# Altium schematic sheet GPRS-ADM2483-V1.0_______中科院TF卡.SchDoc
size A0
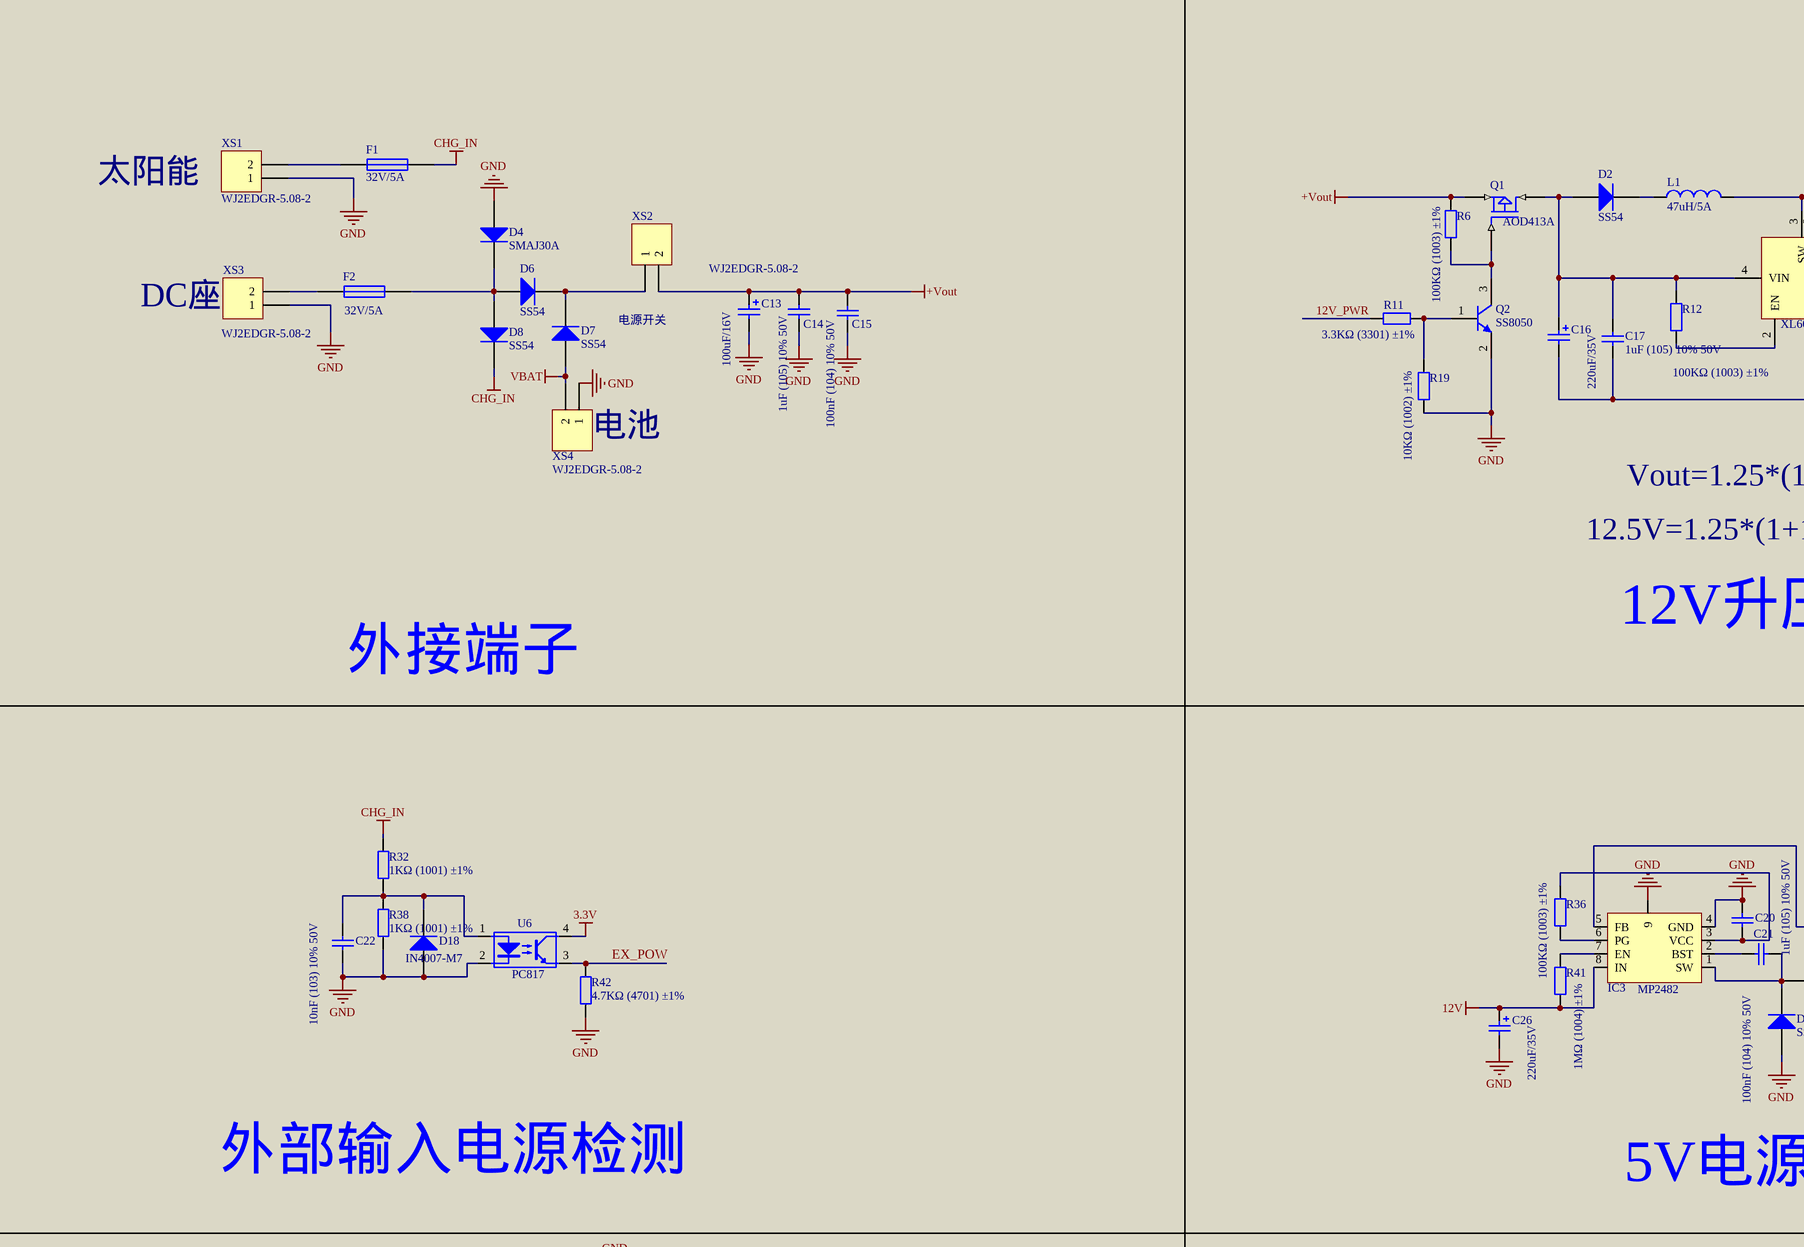
[diagram p0: GPRS-ADM2483-V1.0_______中科院TF卡.SchDoc, top left]
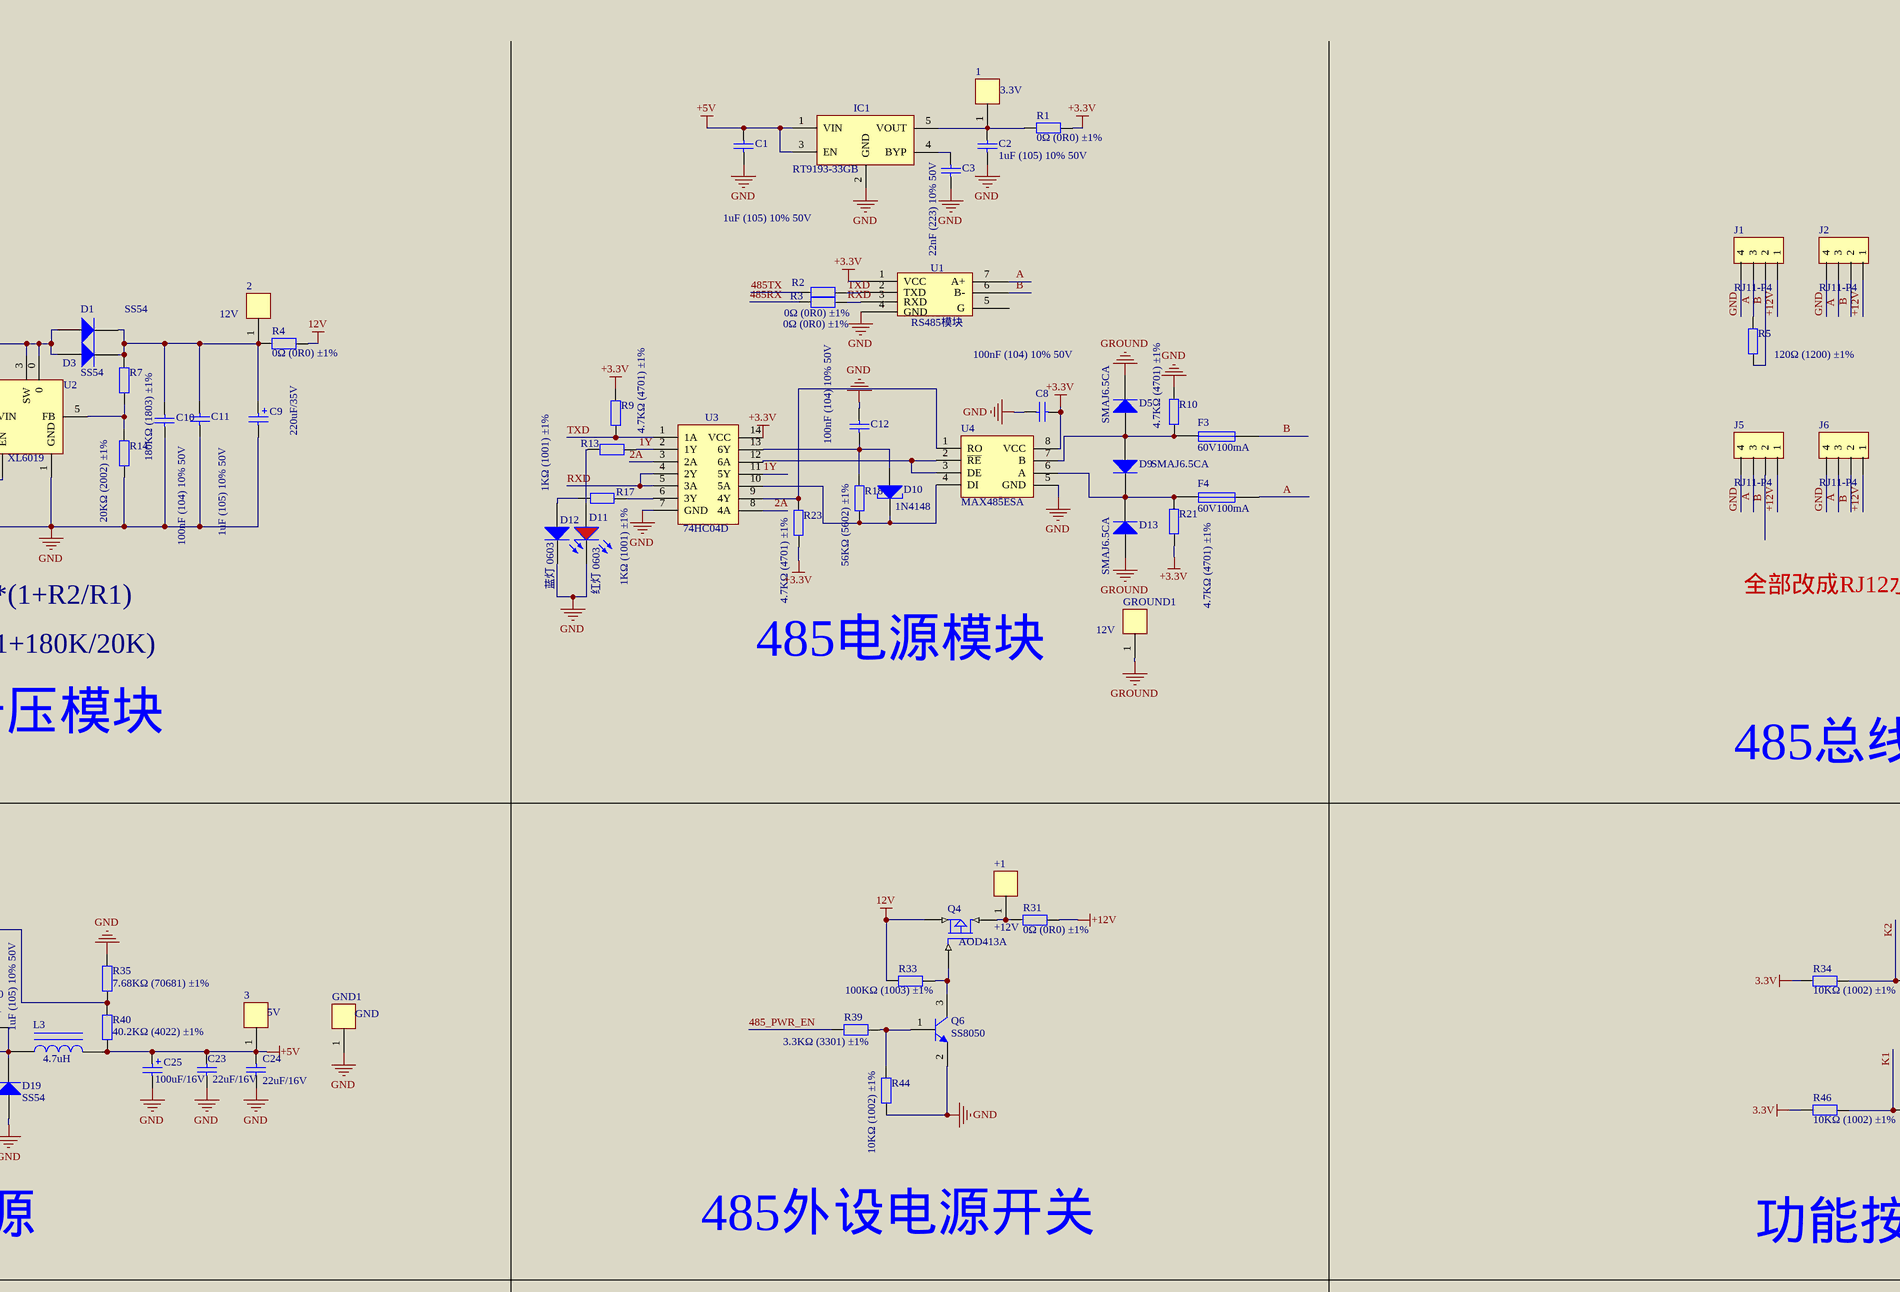
[diagram p1: GPRS-ADM2483-V1.0_______中科院TF卡.SchDoc, top middle]
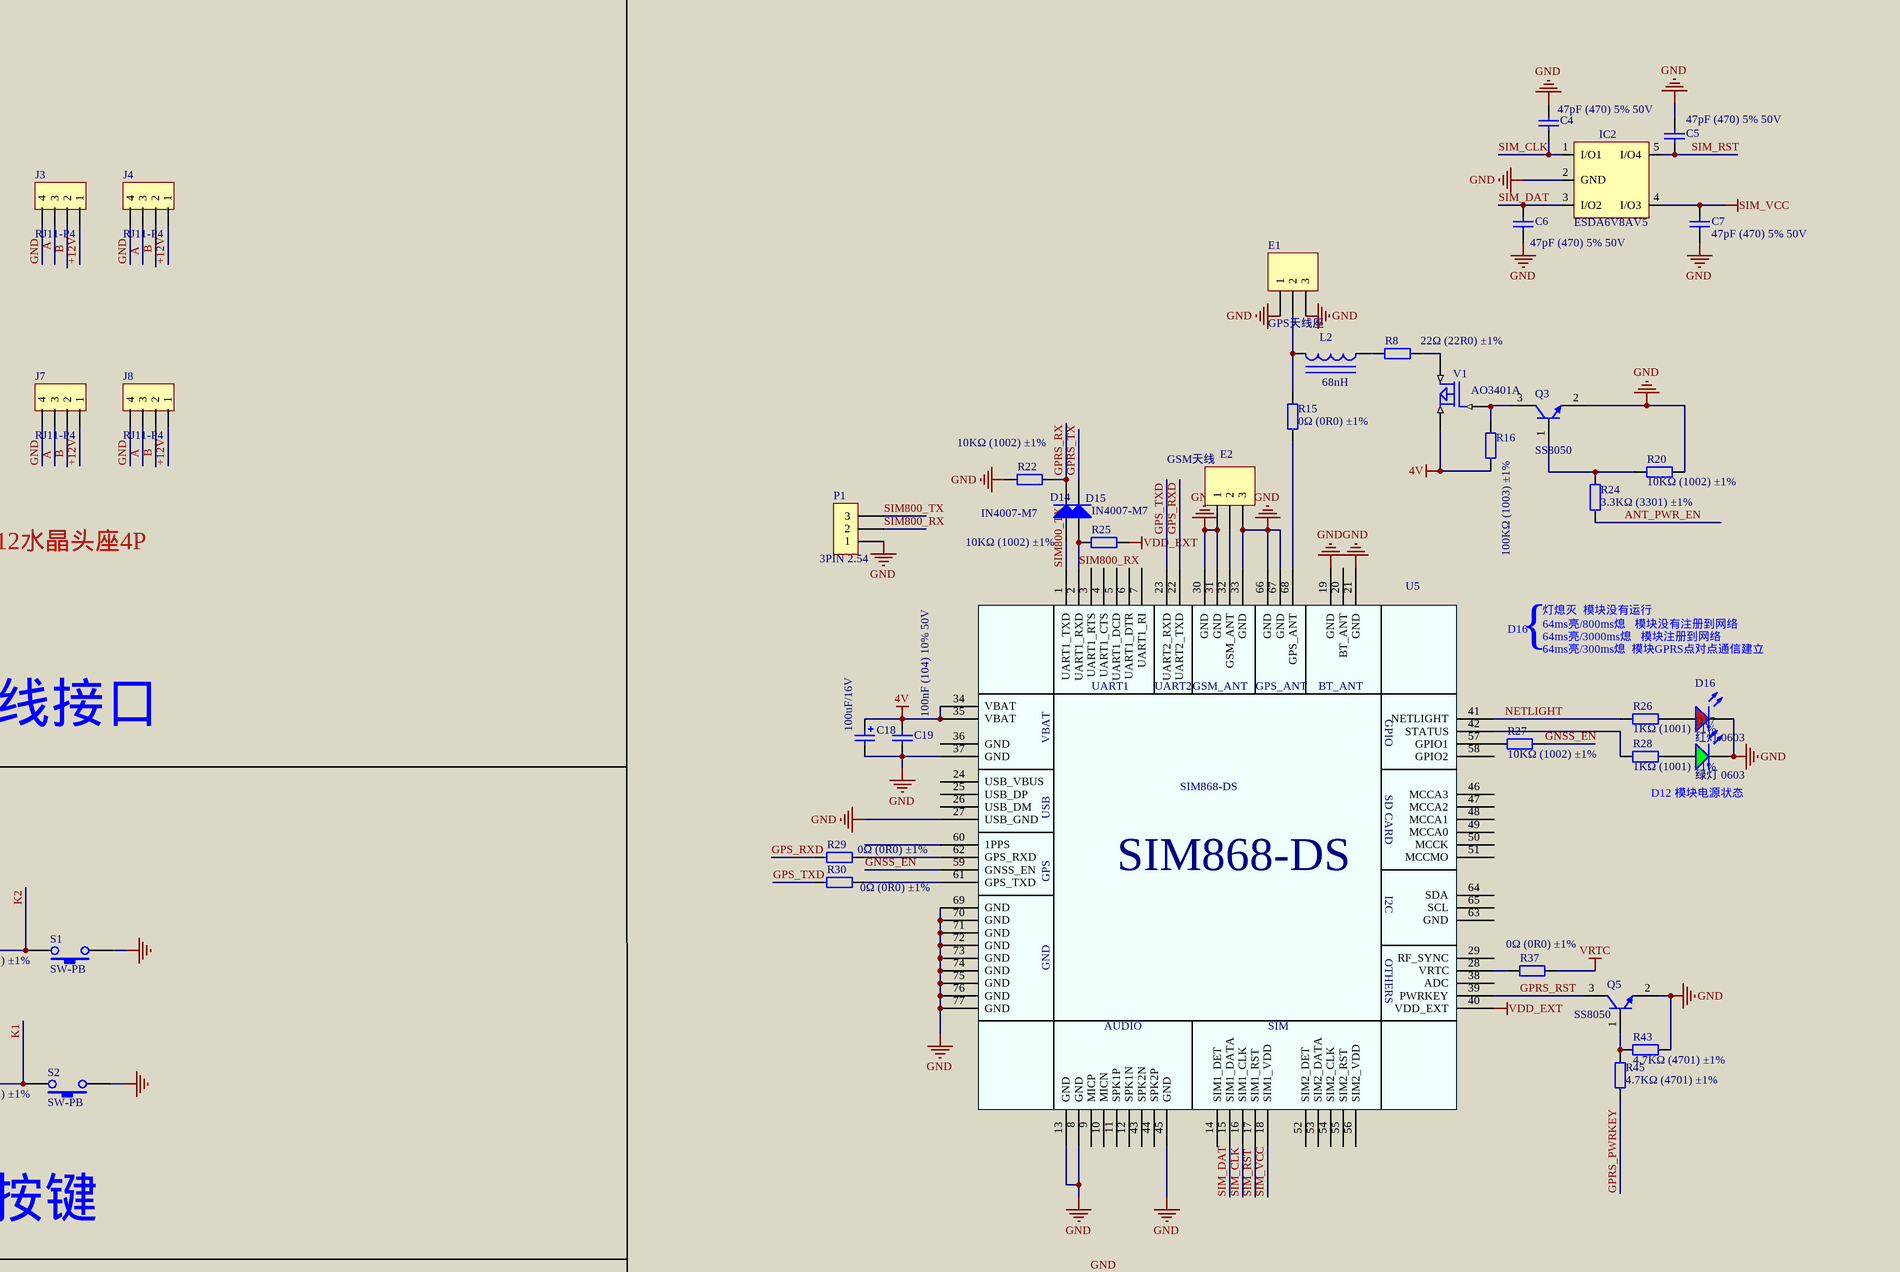
[diagram p2: GPRS-ADM2483-V1.0_______中科院TF卡.SchDoc, top right]
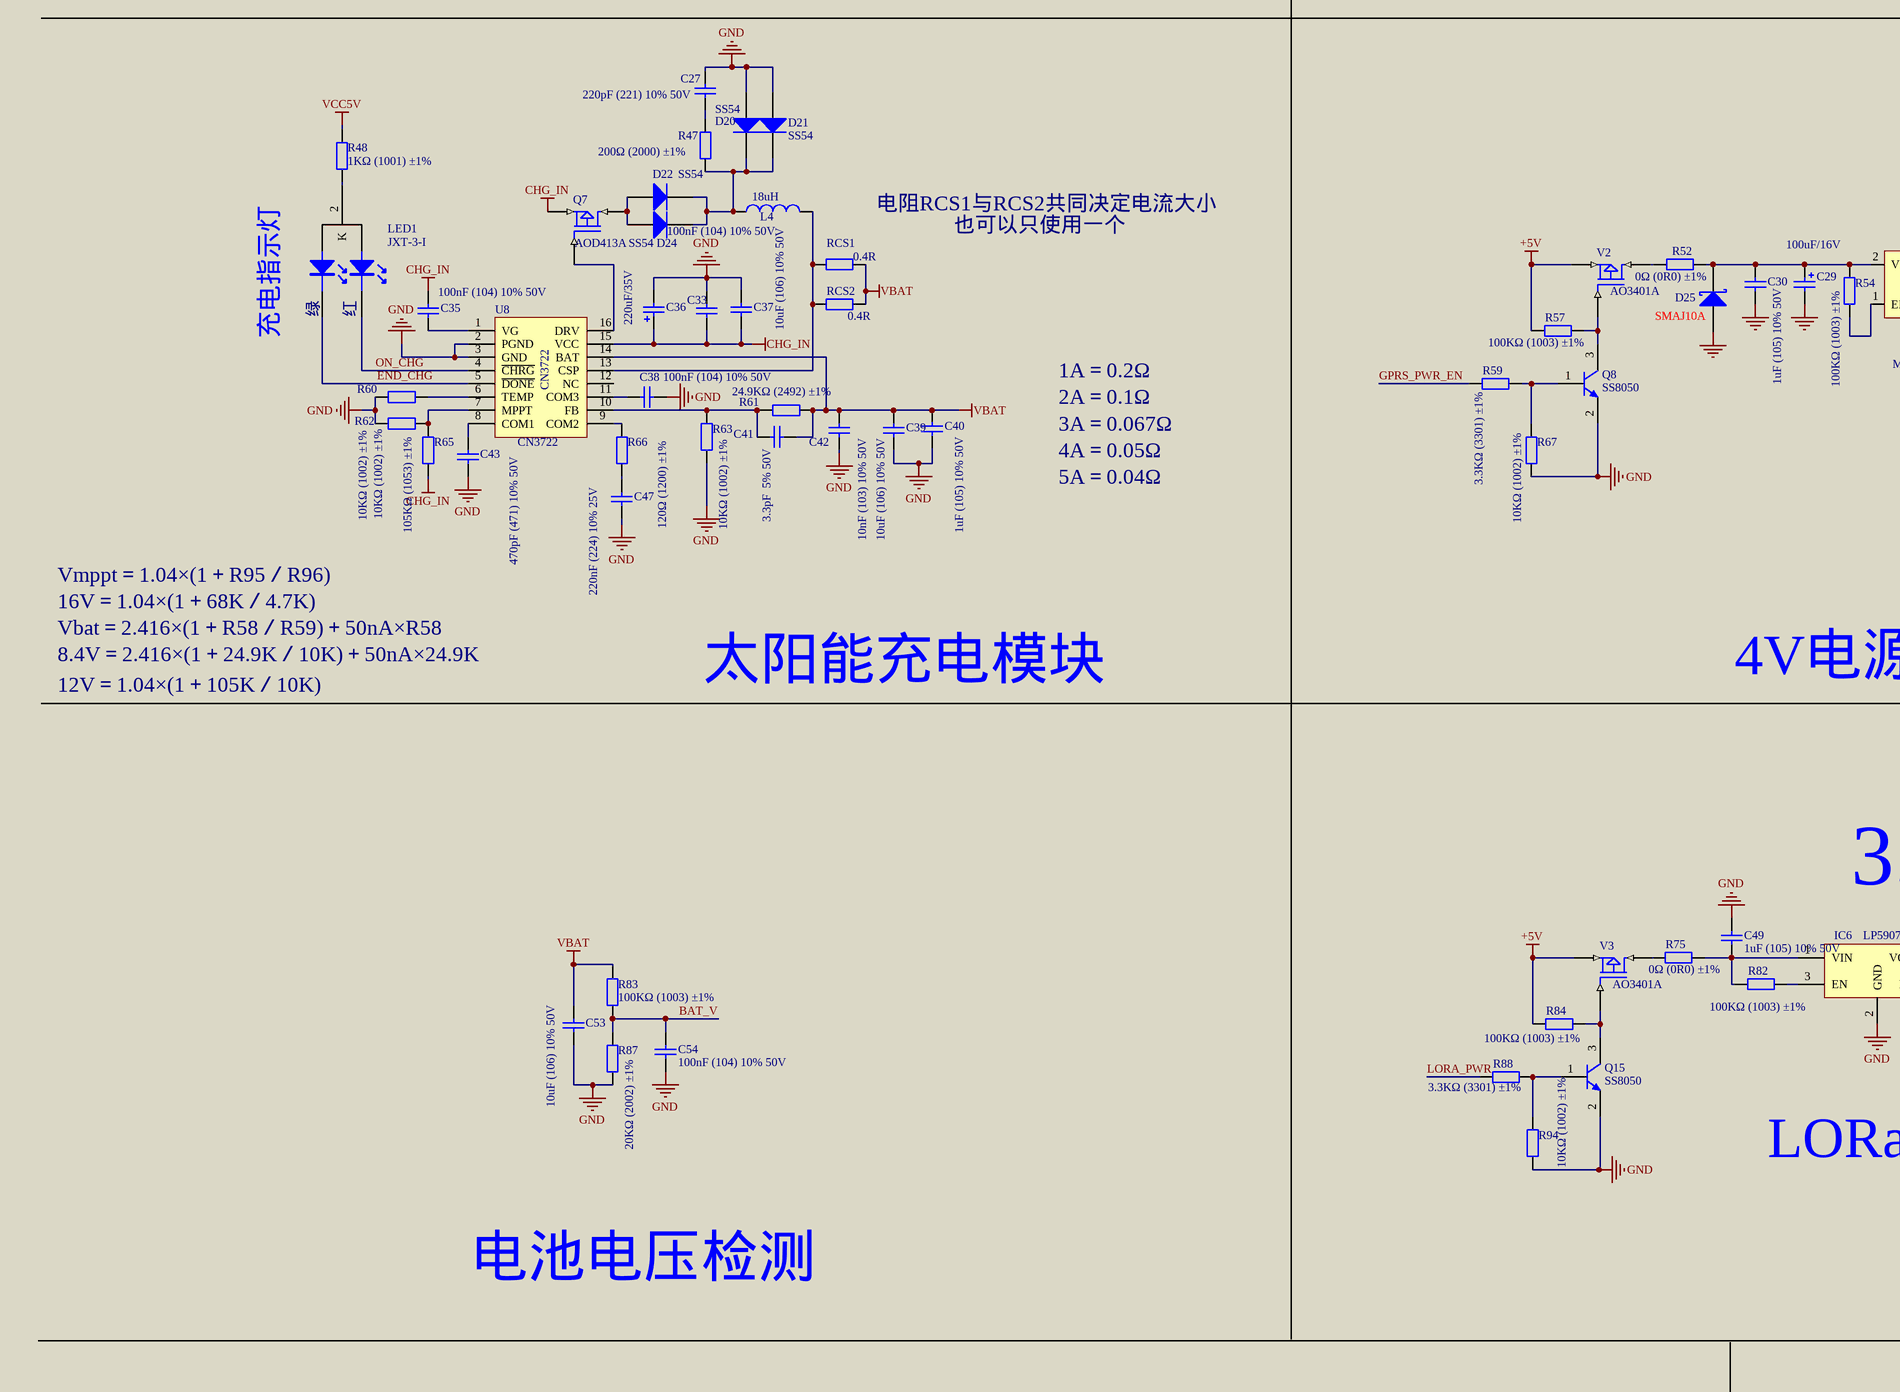
[diagram p3: GPRS-ADM2483-V1.0_______中科院TF卡.SchDoc, centre left]
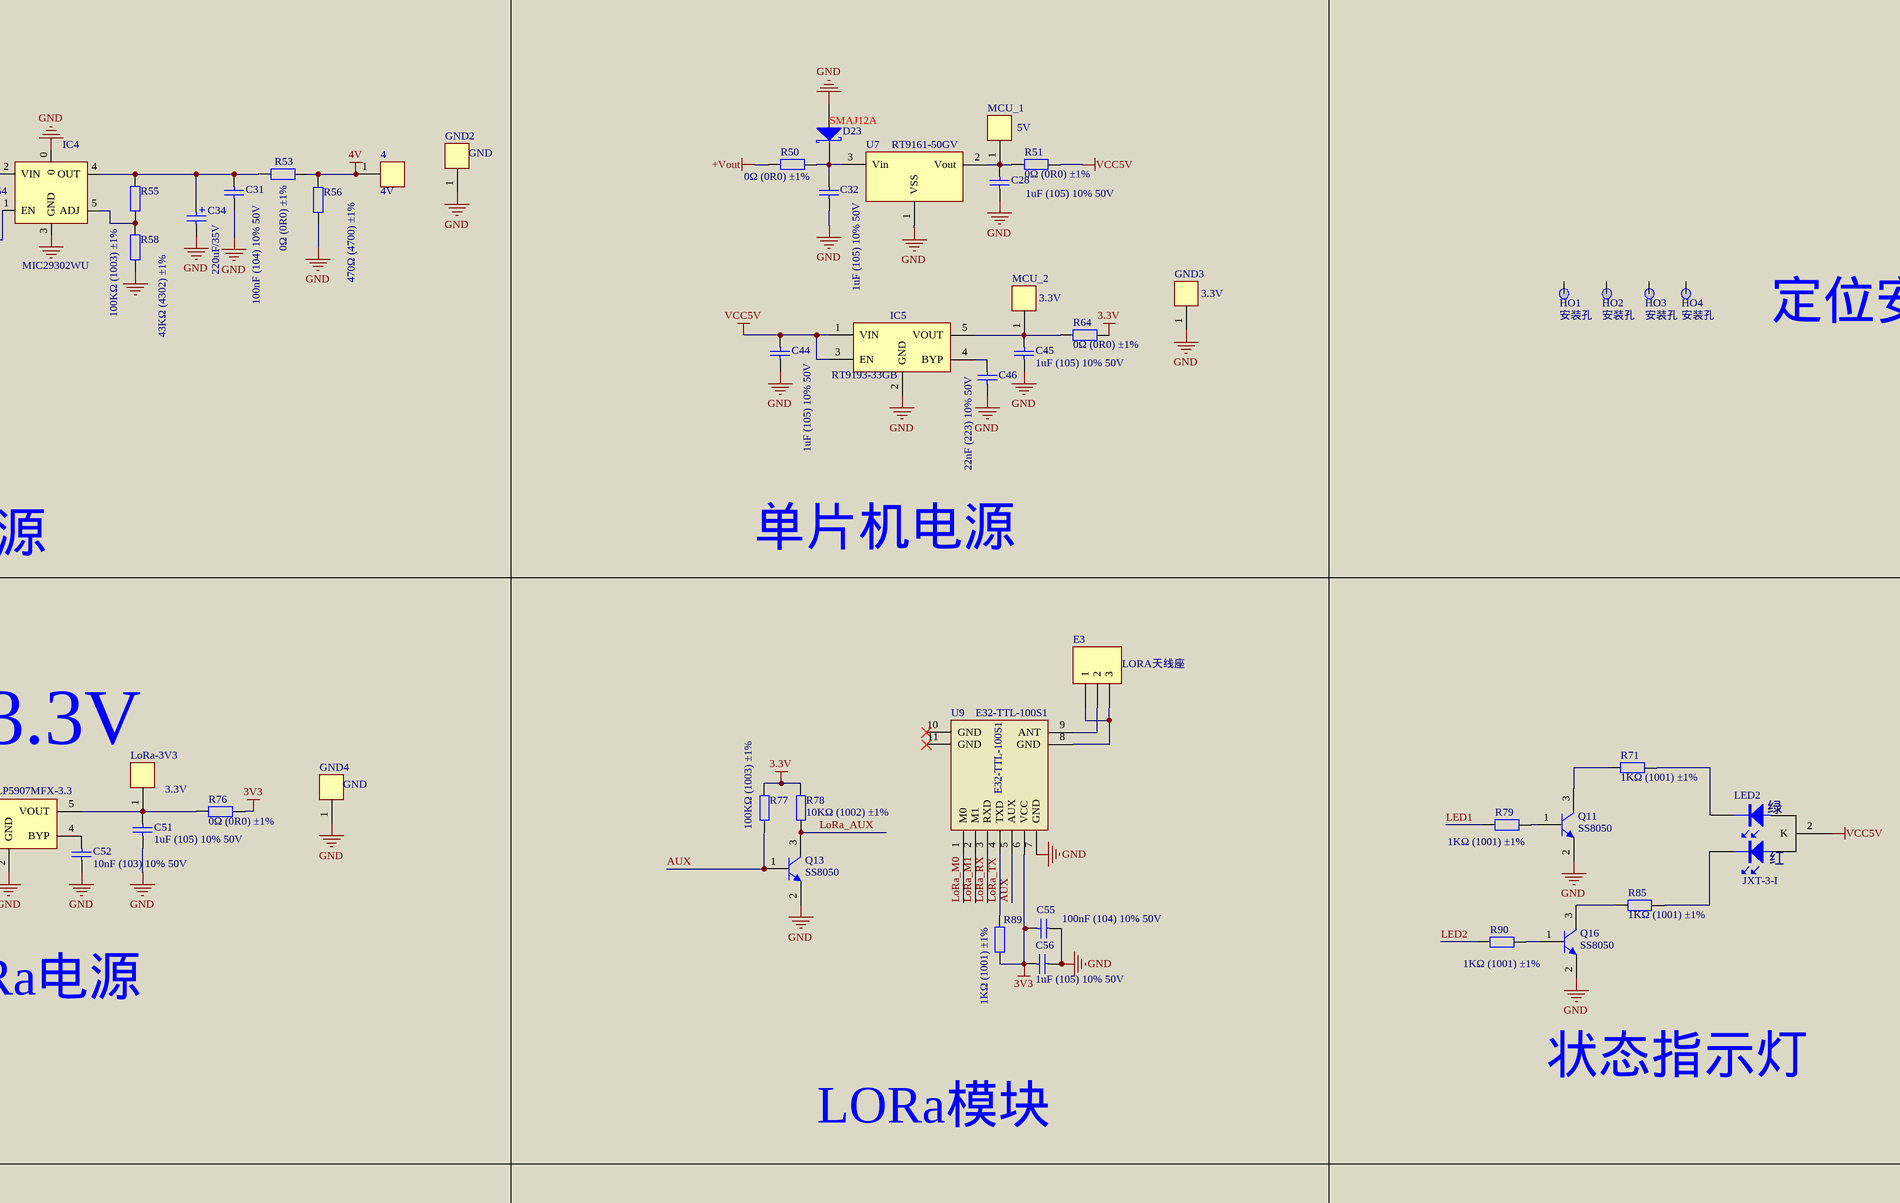
[diagram p4: GPRS-ADM2483-V1.0_______中科院TF卡.SchDoc, centre middle]
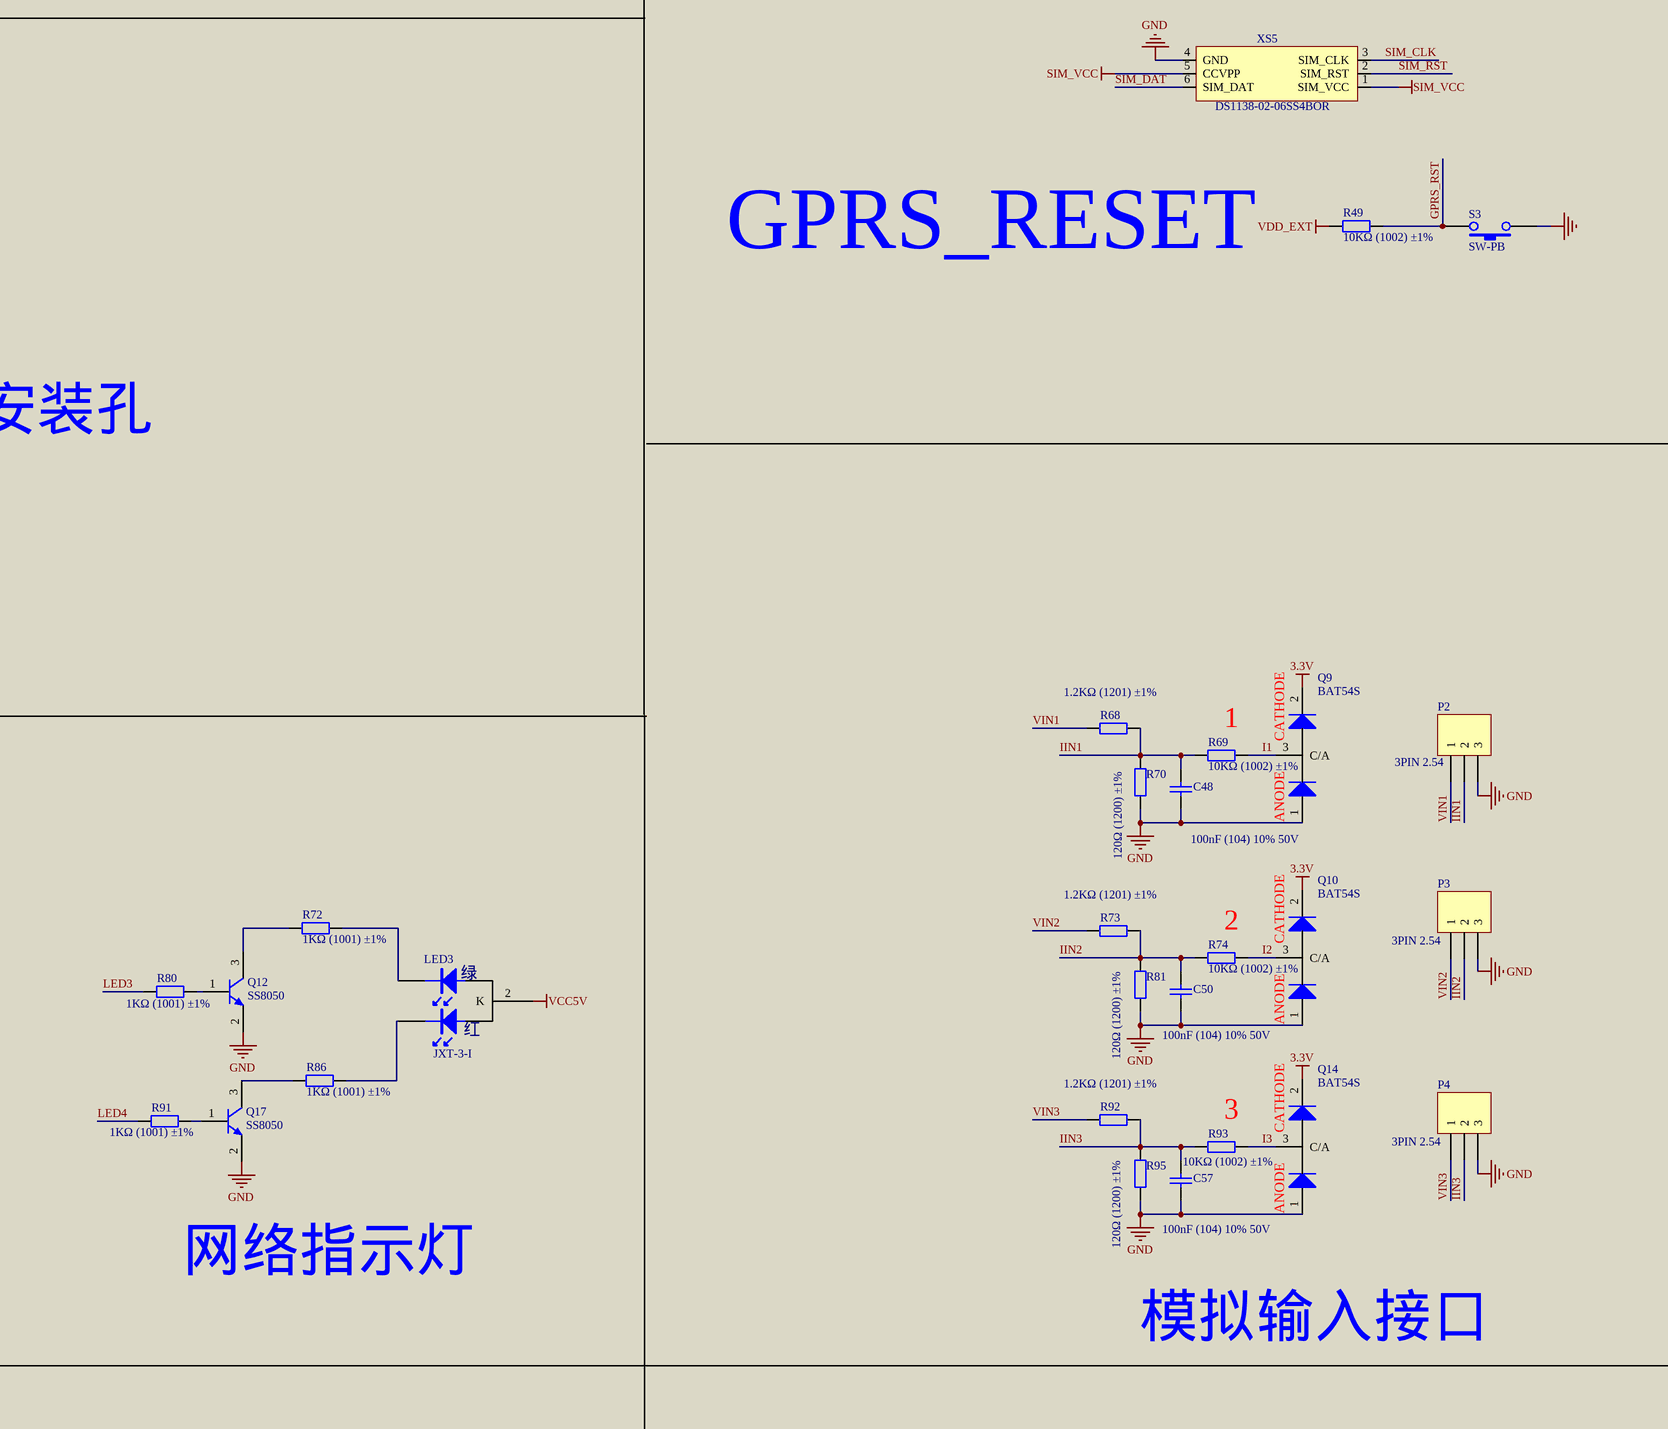
[diagram p5: GPRS-ADM2483-V1.0_______中科院TF卡.SchDoc, centre right]
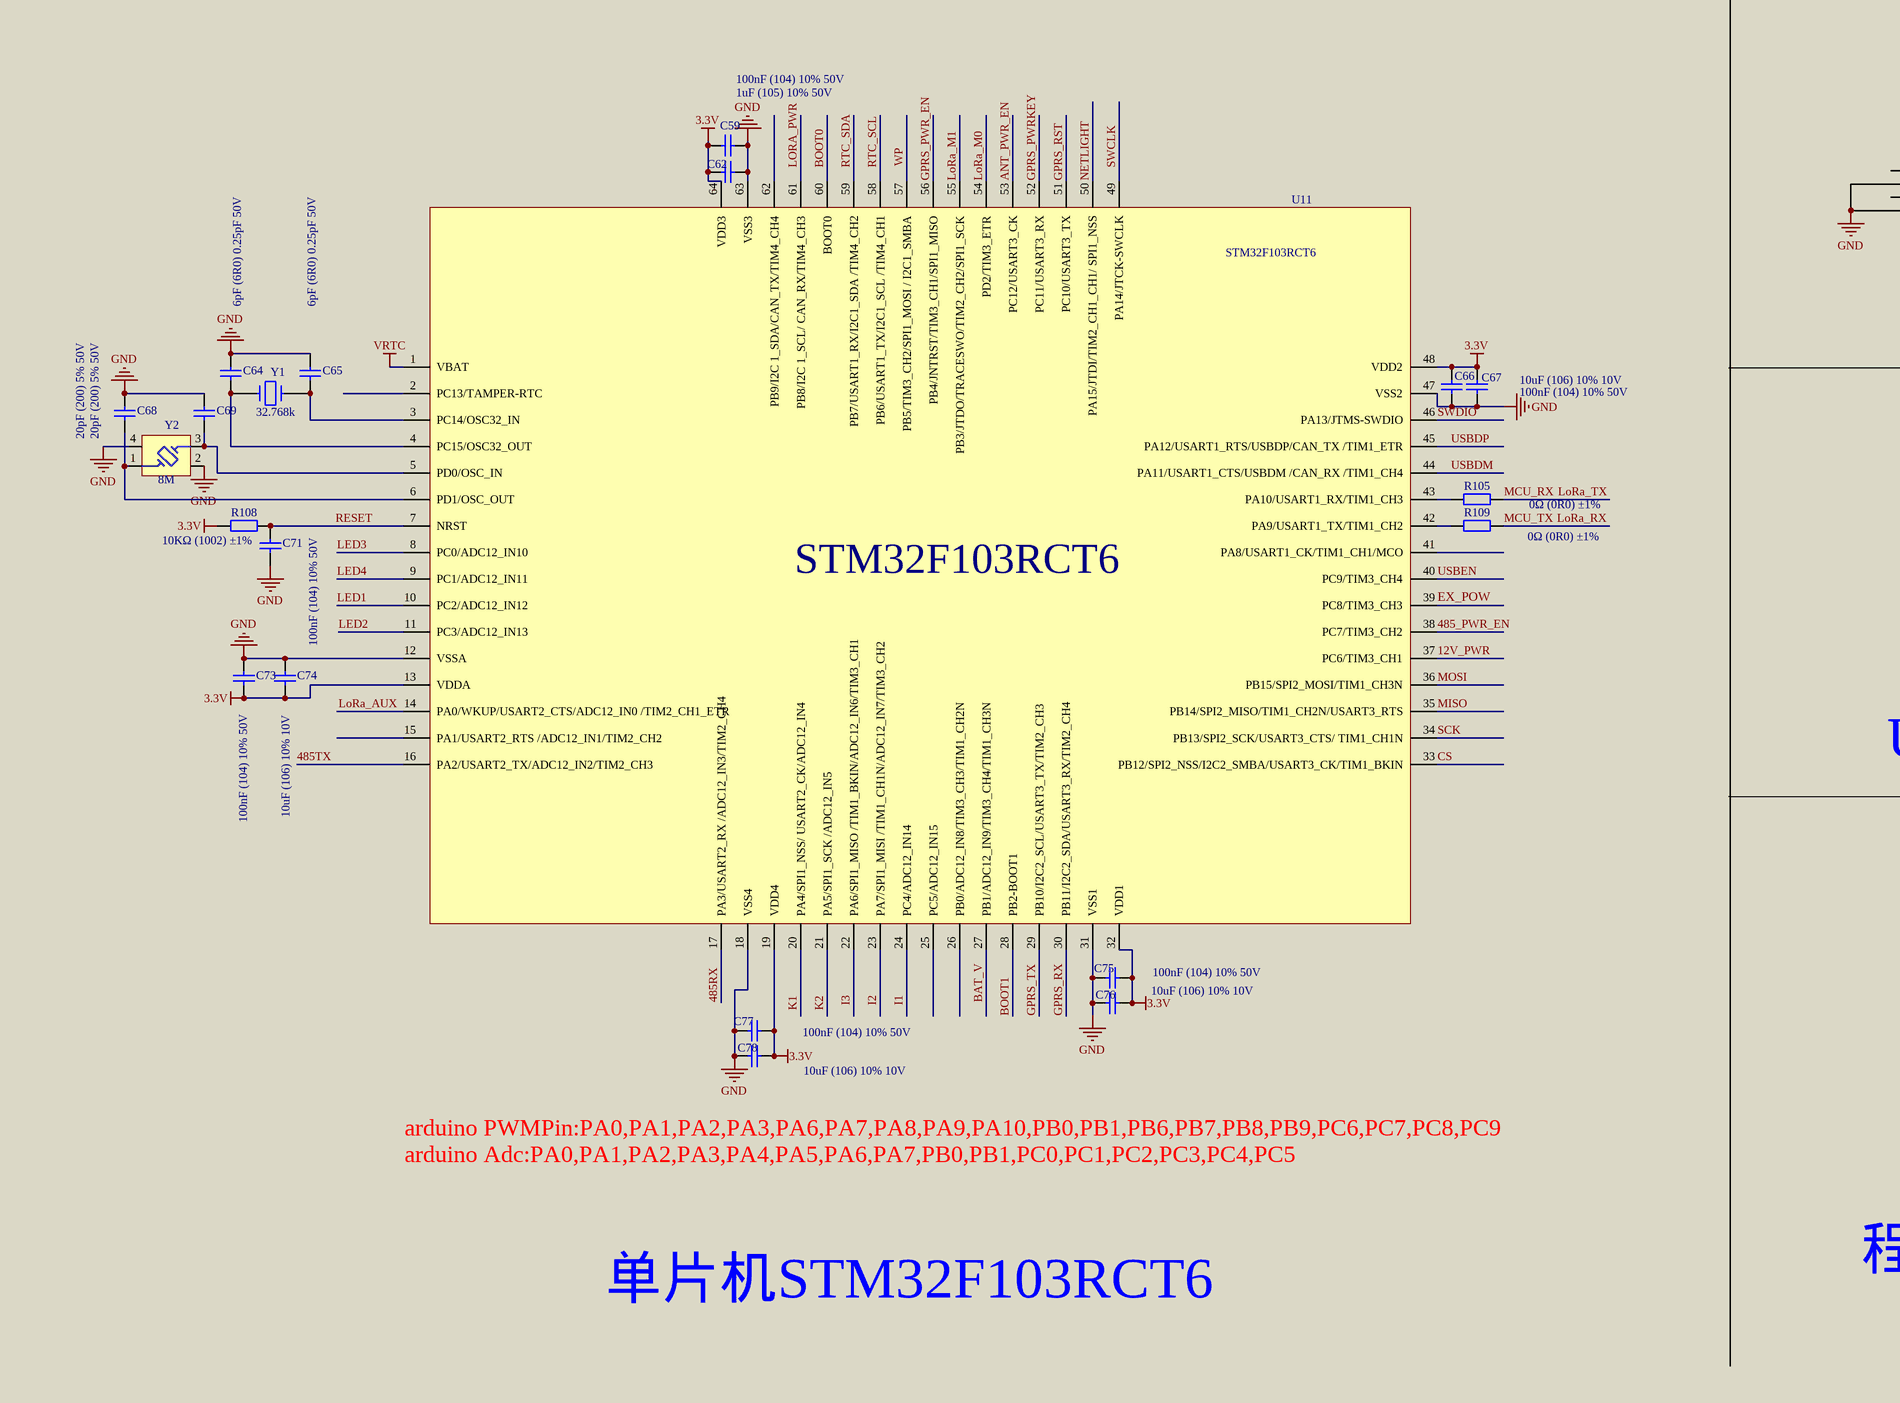
[diagram p6: GPRS-ADM2483-V1.0_______中科院TF卡.SchDoc, bottom left]
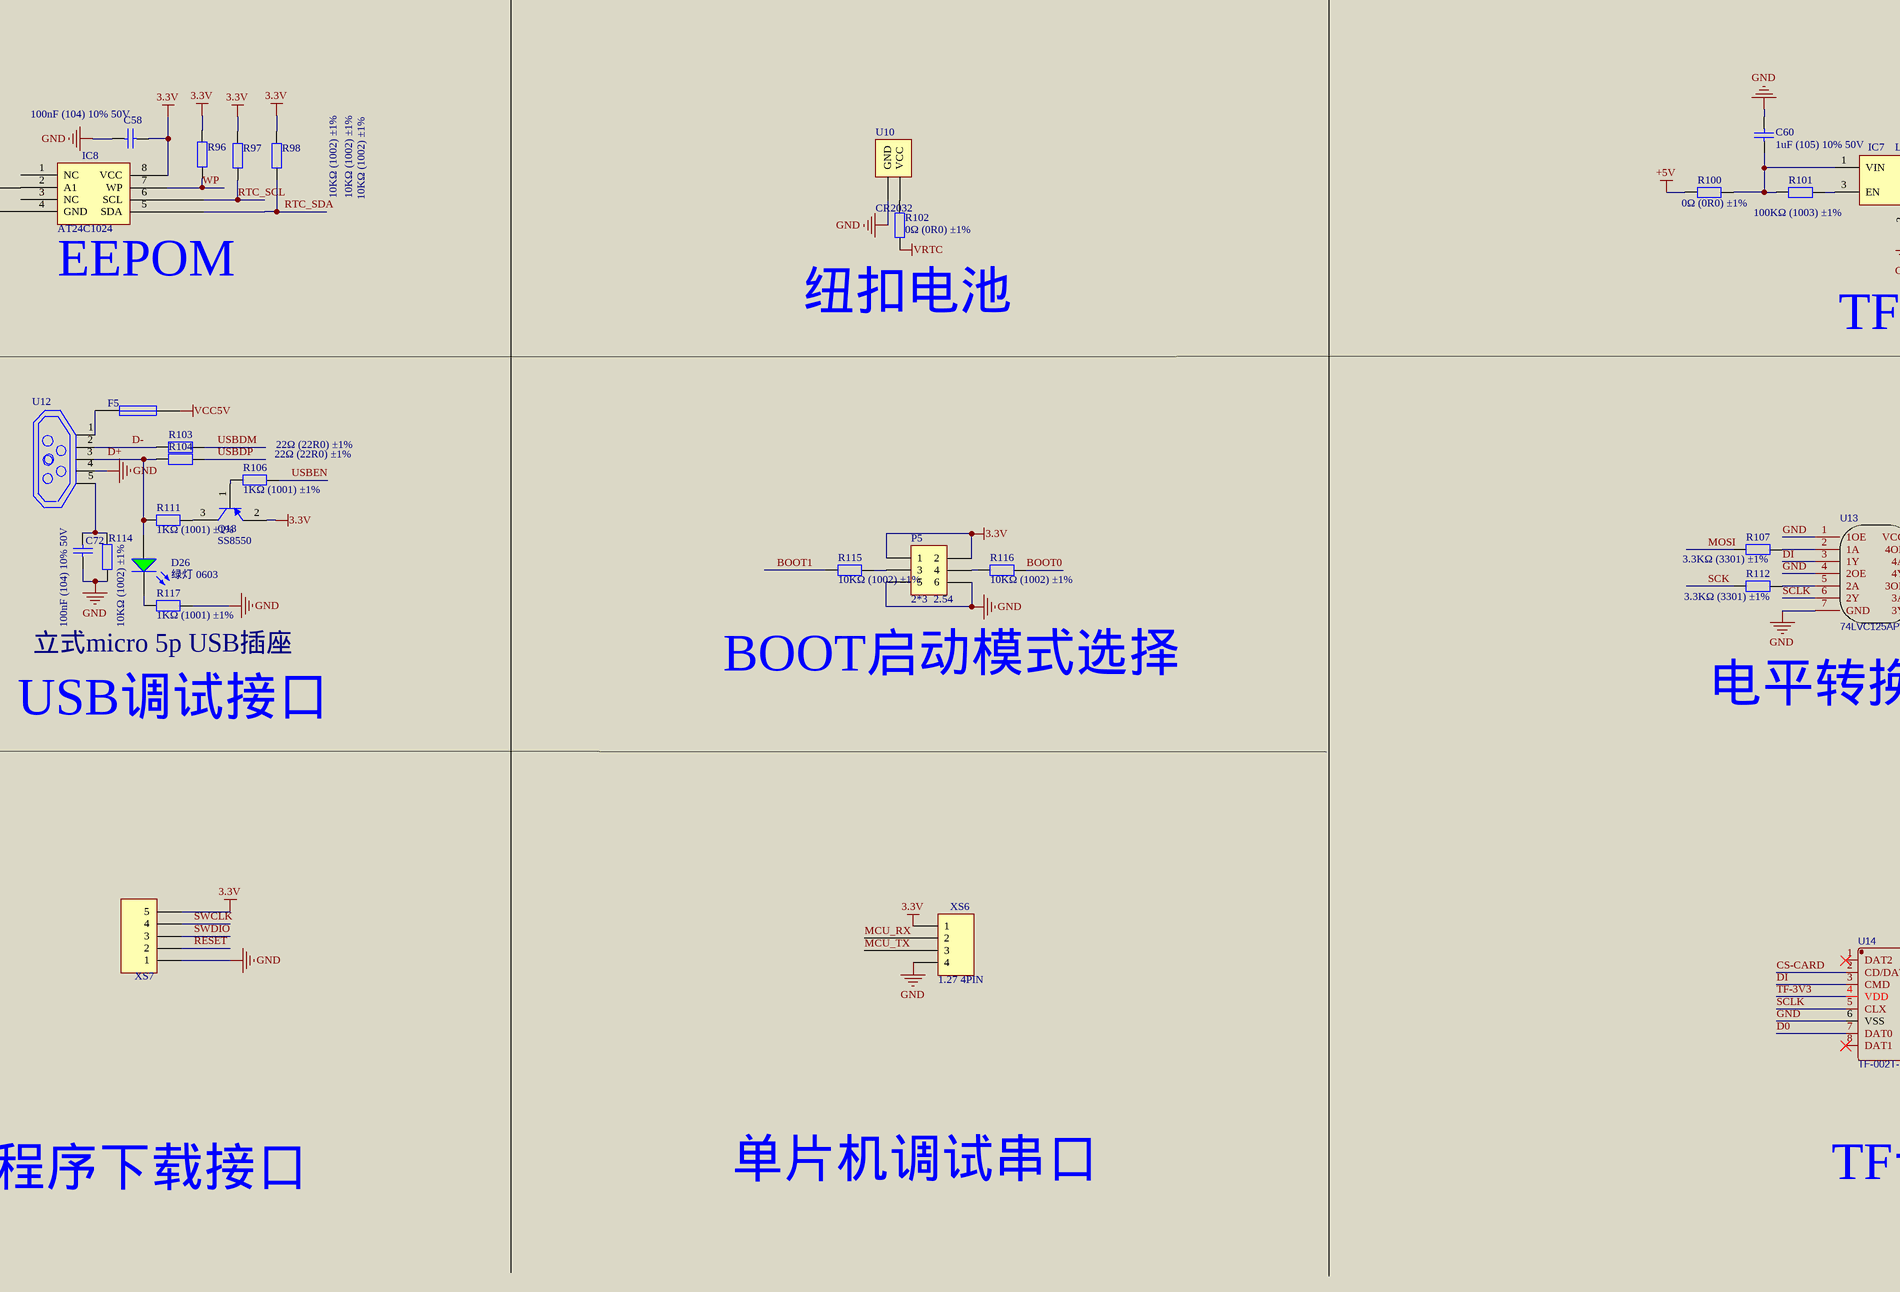
[diagram p7: GPRS-ADM2483-V1.0_______中科院TF卡.SchDoc, bottom middle]
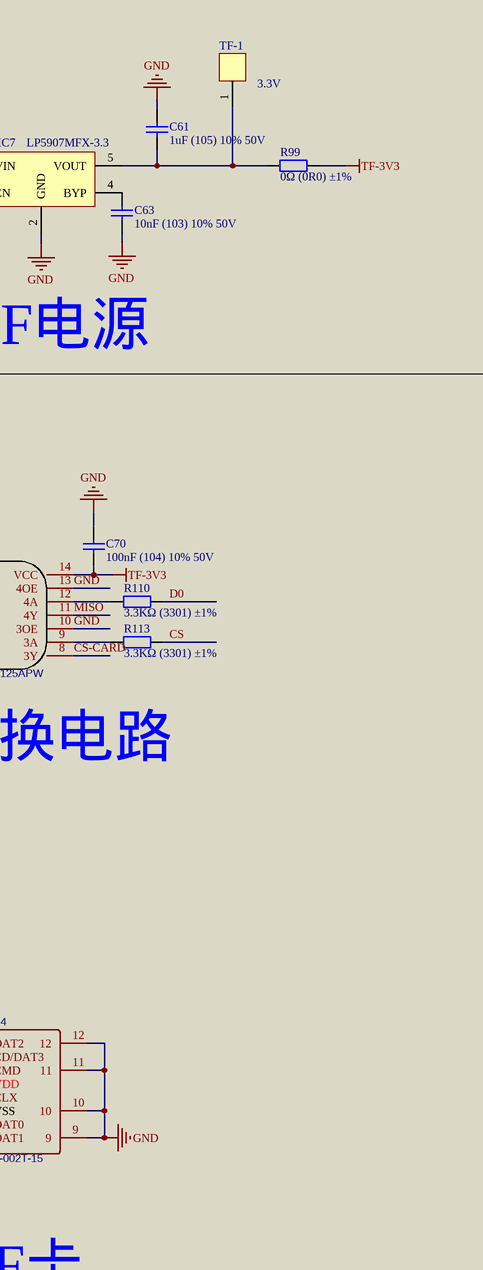
[diagram p8: GPRS-ADM2483-V1.0_______中科院TF卡.SchDoc, bottom right]

## Parts
1  3.3V  [TEST_POINT]
2  12V  [TEST_POINT]
3  5V  [TEST_POINT]
4  4V  [TEST_POINT]
+1  +12V  [TEST_POINT]
C1  1uF (105) 10% 50V  [LC-0603_C]
C2  1uF (105) 10% 50V  [LC-0603_C]
C3  22nF (223) 10% 50V  [LC-0603_C]
C4  47pF (470) 5% 50V  [LC-0603_C]
C5  47pF (470) 5% 50V  [LC-0603_C]
C6  47pF (470) 5% 50V  [LC-0603_C]
C7  47pF (470) 5% 50V  [LC-0603_C]
C8  100nF (104) 10% 50V  [LC-0603_C]
C9  220uF/35V  [CAPAE8*10.5]
C10  100nF (104) 10% 50V  [LC-0603_C]
C11  1uF (105) 10% 50V  [LC-0603_C]
C12  100nF (104) 10% 50V  [LC-0603_C]
C13  100uF/16V  [CAPAE6.3*7.7]
C14  1uF (105) 10% 50V  [LC-0603_C]
C15  100nF (104) 10% 50V  [LC-0603_C]
C16  220uF/35V  [CAPAE8*10.5]
C17  1uF (105) 10% 50V  [LC-0603_C]
C18  100uF/16V  [CAPAE6.3*7.7]
C19  100nF (104) 10% 50V  [LC-0603_C]
C20  1uF (105) 10% 50V  [LC-0603_C]
C21  100nF (104) 10% 50V  [LC-0603_C]
C22  10nF (103) 10% 50V  [LC-0603_C]
C23  22uF/16V  [C-1206]
C24  22uF/16V  [C-1206]
C25  100uF/16V  [CAPAE6.3*7.7]
C26  220uF/35V  [CAPAE8*10.5]
C27  220pF (221) 10% 50V  [LC-0603_C]
C28  1uF (105) 10% 50V  [LC-0603_C]
C29  100uF/16V  [CAPAE6.3*7.7]
C30  1uF (105) 10% 50V  [LC-0603_C]
C31  100nF (104) 10% 50V  [LC-0603_C]
C32  1uF (105) 10% 50V  [LC-0603_C]
C33  100nF (104) 10% 50V  [LC-0603_C]
C34  220uF/35V  [CAPAE8*10.5]
C35  100nF (104) 10% 50V  [LC-0603_C]
C36  220uF/35V  [CAPAE8*10.5]
C37  10uF (106) 10% 50V  [LC-1206_C]
C38  100nF (104) 10% 50V  [LC-0603_C]
C39  10uF (106) 10% 50V  [LC-1206_C]
C40  1uF (105) 10% 50V  [LC-0603_C]
C41  3.3pF  5% 50V  [LC-0603_C]
C42  10nF (103) 10% 50V  [LC-0603_C]
C43  470pF (471) 10% 50V  [LC-0603_C]
C44  1uF (105) 10% 50V  [LC-0603_C]
C45  1uF (105) 10% 50V  [LC-0603_C]
C46  22nF (223) 10% 50V  [LC-0603_C]
C47  220nF (224) 10% 25V  [LC-0603_C]
C48  100nF (104) 10% 50V  [LC-0603_C]
C49  1uF (105) 10% 50V  [LC-0603_C]
C50  100nF (104) 10% 50V  [LC-0603_C]
C51  1uF (105) 10% 50V  [LC-0603_C]
C52  10nF (103) 10% 50V  [LC-0603_C]
C53  10uF (106) 10% 50V  [LC-1206_C]
C54  100nF (104) 10% 50V  [LC-0603_C]
C55  100nF (104) 10% 50V  [LC-0603_C]
C56  1uF (105) 10% 50V  [LC-0603_C]
C57  100nF (104) 10% 50V  [LC-0603_C]
C58  100nF (104) 10% 50V  [LC-0603_C]
C59  1uF (105) 10% 50V  [LC-0603_C]
C60  1uF (105) 10% 50V  [LC-0603_C]
C61  1uF (105) 10% 50V  [LC-0603_C]
C62  100nF (104) 10% 50V  [LC-0603_C]
C63  10nF (103) 10% 50V  [LC-0603_C]
C64  6pF (6R0) 0.25pF 50V  [LC-0603_C]
C65  6pF (6R0) 0.25pF 50V  [LC-0603_C]
C66  10uF (106) 10% 10V  [LC-0603_C]
C67  100nF (104) 10% 50V  [LC-0603_C]
C68  20pF (200) 5% 50V  [LC-0603_C]
C69  20pF (200) 5% 50V  [LC-0603_C]
C70  100nF (104) 10% 50V  [LC-0603_C]
C71  100nF (104) 10% 50V  [LC-0603_C]
C72  100nF (104) 10% 50V  [LC-0603_C]
C73  100nF (104) 10% 50V  [LC-0603_C]
C74  10uF (106) 10% 10V  [LC-0603_C]
C75  100nF (104) 10% 50V  [LC-0603_C]
C76  10uF (106) 10% 10V  [LC-0603_C]
C77  100nF (104) 10% 50V  [LC-0603_C]
C78  10uF (106) 10% 10V  [LC-0603_C]
D1  SS54  [LC-SMA(DO-214AC)_S1]
D2  SS54  [LC-SMA(DO-214AC)_S1]
D3  SS54  [LC-SMA(DO-214AC)_S1]
D4  SMAJ30A  [LC-SMA(DO-214AC)_S5]
D5  SMAJ6.5CA  [DO-214AC]
D6  SS54  [LC-SMA(DO-214AC)_S1]
D7  SS54  [LC-SMA(DO-214AC)_S1]
D8  SS54  [LC-SMA(DO-214AC)_S1]
D9  SMAJ6.5CA  [DO-214AC]
D10  1N4148  [LL-34]
D11  红灯 0603  [LC-0603_LED_S1]
D12  蓝灯 0603  [LC-0603_LED_S1]
D13  SMAJ6.5CA  [DO-214AC]
D14  IN4007-M7  [SMA(DO-214AC)]
D15  IN4007-M7  [SMA(DO-214AC)]
D16  红灯 0603  [LC-0603_LED_S1]
D17  绿灯 0603  [LC-0603_LED_S1]
D18  IN4007-M7  [SMA(DO-214AC)]
D19  SS54  [LC-SMA(DO-214AC)_S1]
D20  SS54  [LC-SMA(DO-214AC)_S1]
D21  SS54  [LC-SMA(DO-214AC)_S1]
D22  SS54  [LC-SMA(DO-214AC)_S1]
D23  SMAJ12A  [SMA(DO-214AC)]
D24  SS54  [LC-SMA(DO-214AC)_S1]
D25  SMAJ10A  [SMA(DO-214AC)]
D26  绿灯 0603  [LC-0603_LED_S1]
E1  GPS天线座  [IPEX1]
E2  GSM天线  [IPEX1]
E3  LORA天线座  [IPEX1]
F1  32V/5A  [Fuse-1206]
F2  32V/5A  [Fuse-1206]
F3  60V100mA  [Fuse-1812]
F4  60V100mA  [Fuse-1812]
F5  32V/5A  [FUSE-1206]  (value not drawn)
GND1  GND  [TEST_POINT]
GND2  GND  [TEST_POINT]
GND3  3.3V  [TEST_POINT]
GND4  GND  [TEST_POINT]
GROUND1  12V  [TEST_POINT]
HO1  安装孔  [安装孔]
HO2  安装孔  [安装孔]
HO3  安装孔  [安装孔]
HO4  安装孔  [安装孔]
IC1  RT9193-33GB  [SOT23-5]
IC2  ESDA6V8AV5  [SOT-553]
IC3  MP2482  [SO8 -TP]
IC4  MIC29302WU  [MIC29302WU]
IC5  RT9193-33GB  [SOT23-5]
IC6  LP5907MFX-3.3  [SOT23-5]
IC7  LP5907MFX-3.3  [SOT23-5]
IC8  AT24C1024  [SO8]
J1  RJ11-P4  [RJ11_P4]
J2  RJ11-P4  [RJ11_P4]
J3  RJ11-P4  [RJ11_P4]
J4  RJ11-P4  [RJ11_P4]
J5  RJ11-P4  [RJ11_P4]
J6  RJ11-P4  [RJ11_P4]
J7  RJ11-P4  [RJ11_P4]
J8  RJ11-P4  [RJ11_P4]
L1  47uH/5A  [Inductot(47uH)]
L2  68nH  [L-0805]
L3  4.7uH  [GDCD8040]
L4  18uH  [GDCD8040]
LED1  JXT-3-I  [JXT-3-l]
LED2  JXT-3-I  [JXT-3-l]
LED3  JXT-3-I  [JXT-3-l]
LoRa-3V3  3.3V  [TEST_POINT]
MCU_1  5V  [TEST_POINT]
MCU_2  3.3V  [TEST_POINT]
P1  3PIN 2.54  [HDR1X3]
P2  3PIN 2.54  [WJ2EDGR-5.08-3]
P3  3PIN 2.54  [WJ2EDGR-5.08-3]
P4  3PIN 2.54  [WJ2EDGR-5.08-3]
P5  2*3  2.54  [201S2X3]
Q1  AOD413A  [TO-252-2]
Q2  SS8050  [SOT-23]
Q3  SS8050  [SOT-23]
Q4  AOD413A  [TO-252-2]
Q5  SS8050  [SOT-23]
Q6  SS8050  [SOT-23]
Q7  AOD413A  [TO-252-2]
Q8  SS8050  [SOT-23]
Q9  BAT54S  [SOT-23-3]
Q10  BAT54S  [SOT-23-3]
Q11  SS8050  [SOT-23]
Q12  SS8050  [SOT-23]
Q13  SS8050  [SOT-23]
Q14  BAT54S  [SOT-23-3]
Q15  SS8050  [SOT-23]
Q16  SS8050  [SOT-23]
Q17  SS8050  [SOT-23]
Q18  SS8550  [SOT-23]
R1  0Ω (0R0) ±1%  [LC-0603_R]
R2  0Ω (0R0) ±1%  [LC-0603_R]
R3  0Ω (0R0) ±1%  [LC-0603_R]
R4  0Ω (0R0) ±1%  [LC-0603_R]
R5  120Ω (1200) ±1%  [LC-0603_R]
R6  100KΩ (1003) ±1%  [LC-0603_R]
R7  180KΩ (1803) ±1%  [LC-0603_R]
R8  22Ω (22R0) ±1%  [LC-0603_R]
R9  4.7KΩ (4701) ±1%  [LC-0603_R]
R10  4.7KΩ (4701) ±1%  [LC-0603_R]
R11  3.3KΩ (3301) ±1%  [LC-0603_R]
R12  100KΩ (1003) ±1%  [LC-0603_R]
R13  1KΩ (1001) ±1%  [LC-0603_R]
R14  20KΩ (2002) ±1%  [LC-0603_R]
R15  0Ω (0R0) ±1%  [LC-0603_R]
R16  100KΩ (1003) ±1%  [LC-0603_R]
R17  1KΩ (1001) ±1%  [LC-0603_R]
R18  56KΩ (5602) ±1%  [LC-0603_R]
R19  10KΩ (1002) ±1%  [LC-0603_R]
R20  10KΩ (1002) ±1%  [LC-0603_R]
R21  4.7KΩ (4701) ±1%  [LC-0603_R]
R22  10KΩ (1002) ±1%  [LC-0603_R]
R23  4.7KΩ (4701) ±1%  [LC-0603_R]
R24  3.3KΩ (3301) ±1%  [LC-0603_R]
R25  10KΩ (1002) ±1%  [LC-0603_R]
R26  1KΩ (1001) ±1%  [LC-0603_R]
R27  10KΩ (1002) ±1%  [LC-0603_R]
R28  1KΩ (1001) ±1%  [LC-0603_R]
R29  0Ω (0R0) ±1%  [LC-0603_R]
R30  0Ω (0R0) ±1%  [LC-0603_R]
R31  0Ω (0R0) ±1%  [LC-0603_R]
R32  1KΩ (1001) ±1%  [LC-0603_R]
R33  100KΩ (1003) ±1%  [LC-0603_R]
R34  10KΩ (1002) ±1%  [LC-0603_R]
R35  7.68KΩ (70681) ±1%  [LC-0603_R]
R36  100KΩ (1003) ±1%  [LC-0603_R]
R37  0Ω (0R0) ±1%  [LC-0603_R]
R38  1KΩ (1001) ±1%  [LC-0603_R]
R39  3.3KΩ (3301) ±1%  [LC-0603_R]
R40  40.2KΩ (4022) ±1%  [LC-0603_R]
R41  1MΩ (1004) ±1%  [LC-0603_R]
R42  4.7KΩ (4701) ±1%  [LC-0603_R]
R43  4.7KΩ (4701) ±1%  [LC-0603_R]
R44  10KΩ (1002) ±1%  [LC-0603_R]
R45  4.7KΩ (4701) ±1%  [LC-0603_R]
R46  10KΩ (1002) ±1%  [LC-0603_R]
R47  200Ω (2000) ±1%  [LC-0603_R]
R48  1KΩ (1001) ±1%  [LC-0603_R]
R49  10KΩ (1002) ±1%  [LC-0603_R]
R50  0Ω (0R0) ±1%  [LC-0603_R]
R51  0Ω (0R0) ±1%  [LC-0603_R]
R52  0Ω (0R0) ±1%  [LC-0603_R]
R53  0Ω (0R0) ±1%  [LC-0603_R]
R54  100KΩ (1003) ±1%  [LC-0603_R]
R55  100KΩ (1003) ±1%  [LC-0603_R]
R56  470Ω (4700) ±1%  [LC-0603_R]
R57  100KΩ (1003) ±1%  [LC-0603_R]
R58  43KΩ (4302) ±1%  [LC-0603_R]
R59  3.3KΩ (3301) ±1%  [LC-0603_R]
R60  10KΩ (1002) ±1%  [LC-0603_R]
R61  24.9KΩ (2492) ±1%  [LC-0603_R]
R62  10KΩ (1002) ±1%  [LC-0603_R]
R63  10KΩ (1002) ±1%  [LC-0603_R]
R64  0Ω (0R0) ±1%  [LC-0603_R]
R65  105KΩ (1053) ±1%  [LC-0603_R]
R66  120Ω (1200) ±1%  [LC-0603_R]
R67  10KΩ (1002) ±1%  [LC-0603_R]
R68  1.2KΩ (1201) ±1%  [LC-0603_R]
R69  10KΩ (1002) ±1%  [LC-0603_R]
R70  120Ω (1200) ±1%  [LC-0603_R]
R71  1KΩ (1001) ±1%  [LC-0603_R]
R72  1KΩ (1001) ±1%  [LC-0603_R]
R73  1.2KΩ (1201) ±1%  [LC-0603_R]
R74  10KΩ (1002) ±1%  [LC-0603_R]
R75  0Ω (0R0) ±1%  [LC-0603_R]
R76  0Ω (0R0) ±1%  [LC-0603_R]
R77  100KΩ (1003) ±1%  [LC-0603_R]
R78  10KΩ (1002) ±1%  [LC-0603_R]
R79  1KΩ (1001) ±1%  [LC-0603_R]
R80  1KΩ (1001) ±1%  [LC-0603_R]
R81  120Ω (1200) ±1%  [LC-0603_R]
R82  100KΩ (1003) ±1%  [LC-0603_R]
R83  100KΩ (1003) ±1%  [LC-0603_R]
R84  100KΩ (1003) ±1%  [LC-0603_R]
R85  1KΩ (1001) ±1%  [LC-0603_R]
R86  1KΩ (1001) ±1%  [LC-0603_R]
R87  20KΩ (2002) ±1%  [LC-0603_R]
R88  3.3KΩ (3301) ±1%  [LC-0603_R]
R89  1KΩ (1001) ±1%  [LC-0603_R]
R90  1KΩ (1001) ±1%  [LC-0603_R]
R91  1KΩ (1001) ±1%  [LC-0603_R]
R92  1.2KΩ (1201) ±1%  [LC-0603_R]
R93  10KΩ (1002) ±1%  [LC-0603_R]
R94  10KΩ (1002) ±1%  [LC-0603_R]
R95  120Ω (1200) ±1%  [LC-0603_R]
R96  10KΩ (1002) ±1%  [LC-0603_R]
R97  10KΩ (1002) ±1%  [LC-0603_R]
R98  10KΩ (1002) ±1%  [LC-0603_R]
R99  0Ω (0R0) ±1%  [LC-0603_R]
R100  0Ω (0R0) ±1%  [LC-0603_R]
R101  100KΩ (1003) ±1%  [LC-0603_R]
R102  0Ω (0R0) ±1%  [LC-0603_R]
R103  22Ω (22R0) ±1%  [LC-0603_R]
R104  22Ω (22R0) ±1%  [LC-0603_R]
R105  0Ω (0R0) ±1%  [LC-0603_R]
R106  1KΩ (1001) ±1%  [LC-0603_R]
R107  3.3KΩ (3301) ±1%  [LC-0603_R]
R108  10KΩ (1002) ±1%  [LC-0603_R]
R109  0Ω (0R0) ±1%  [LC-0603_R]
R110  3.3KΩ (3301) ±1%  [LC-0603_R]
R111  1KΩ (1001) ±1%  [LC-0603_R]
R112  3.3KΩ (3301) ±1%  [LC-0603_R]
R113  3.3KΩ (3301) ±1%  [LC-0603_R]
R114  10KΩ (1002) ±1%  [LC-0603_R]
R115  10KΩ (1002) ±1%  [LC-0603_R]
R116  10KΩ (1002) ±1%  [LC-0603_R]
R117  1KΩ (1001) ±1%  [LC-0603_R]
RCS1  0.4R  [R-2512]
RCS2  0.4R  [R-2512]
S1  SW-PB  [JXT-2-l]
S2  SW-PB  [JXT-2-l]
S3  SW-PB  [轻触(3*6*4.3)]
TF-1  3.3V  [TEST_POINT]
U1  RS485模块  [RS485MOD]
U2  XL6019  [TO-263-5]
U3  74HC04D  [SOIC-14_150mil]
U4  MAX485ESA  [SOP-8_150mil]
U5  SIM868-DS  [SIM868]
U6  PC817  [PC817]
U7  RT9161-50GV  [SOT-23-3]
U8  CN3722  [TSSOP-16]
U9  E32-TTL-100S1  [E32-TTL-100S1]
U10  CR2032  [CR2032 - 1]
U11  STM32F103RCT6  [LQFP-64_10x10x05P]
U12  立式micro 5p USB插座  [USB插座 micro 5p]
U13  74LVC125APW  [TSSOP-14]
U14  TF-002T-15  [TF-002T-15]
V1  AO3401A  [SOT-23-3L]
V2  AO3401A  [SOT-23-3L]
V3  AO3401A  [SOT-23-3L]
XS1  WJ2EDGR-5.08-2  [WJ2EDGR-5.08-2]
XS2  WJ2EDGR-5.08-2  [WJ2EDGR-5.08-2]
XS3  WJ2EDGR-5.08-2  [WJ2EDGR-5.08-2]
XS4  WJ2EDGR-5.08-2  [WJ2EDGR-5.08-2]
XS5  DS1138-02-06SS4BOR  [SIM-1]
XS6  1.27 4PIN  [JXT-4]
XS7  1.25X4  [JXT-5]  (value not drawn)
Y1  32.768k  [3215_32.768K]
Y2  8M  [SMD-5032_4P]

## Nets
3.3V: C58.2 C59.1 C62.1 C66.2 C67.2 C73.2 C74.2 C75.1 C76.1 C77.1 C78.1 IC8.8(VCC) P5.1 P5.2 Q9.2(CATHODE) Q10.2(CATHODE) Q14.2(CATHODE) Q18.2(E) R34.1 R46.1 R64.2 R77.2 R78.2 R96.2 R97.2 R98.2 R108.1 U6.4(Collector) U11.13(VDDA) U11.19(VDD4) U11.32(VDD1) U11.48(VDD2) U11.64(VDD3) XS6.1 XS7.5
3V3: C55.1 C56.1 R76.2 R89.1 U9.6(VCC)
4V: 4.1 C18.1 C19.2 R16.1 R53.2 R56.2 U5.34(VBAT) U5.35(VBAT) V1.2(S)
12V: C26.1 IC3.8(IN) Q4.3(S) R4.2 R33.1 R41.1
+3.3V: C8.1 R1.2 R9.2 R21.1 R23.1 U1.1(VCC) U3.14(VCC) U4.8(VCC)
+5V: 3.1 C1.2 C23.2 C24.2 C25.1 IC1.1(VIN) IC1.3(EN) L3.2 R40.1 R57.1 R84.1 R100.1 V2.2(S) V3.2(S)
+12V: J1.1 J2.1 J3.1 J4.1 J5.1 J6.1 J7.1 J8.1 R31.2
+Vout: C13.1 C14.2 C15.2 Q1.3(S) R6.2 R50.1 XS2.2
CHG_IN: C33.1 C35.2 C36.1 C37.1 D8.2(K) F1.2 Q7.3(S) R32.2 R65.2 U8.15(VCC)
GND: C1.1 C2.1 C3.1 C4.2 C5.2 C6.1 C7.1 C8.2 C9.2 C10.1 C11.1 C12.2 C13.2 C14.1 C15.1 C16.2 C17.1 C18.2 C19.1 C20.2 C22.1 C23.1 C24.1 C25.2 C26.2 C27.2 C28.1 C29.2 C30.1 C31.1 C32.1 C33.2 C34.2 C36.2 C37.2 C38.2 C39.1 C40.1 C42.1 C43.1 C44.1 C45.1 C46.1 C47.1 C48.1 C49.2 C50.1 C51.1 C52.1 C53.1 C54.1 C55.2 C56.2 C57.1 C58.1 C59.2 C60.2 C61.1 C62.2 C63.1 C64.2 C65.2 C66.1 C67.1 C68.2 C69.2 C70.2 C71.2 C72.1 C73.1 C74.1 C75.2 C76.2 C77.2 C78.2 D4.1(A) D11.K D12.K D16.K D17.K D18.1(A) D19.1(A) D20.1(A) D21.1(A) D23.1(A) D25.1(A) E1.1 E1.3 E2.1 E2.3 GND1.1 GND2.1 GND3.1 GND4.1 IC1.2(GND) IC2.2(GND) IC3.4(GND) IC3.9 IC4.0 IC4.3(GND) IC5.2(GND) IC6.2(GND) IC7.2(GND) IC8.2(A1) IC8.4(GND) J1.4 J2.4 J3.4 J4.4 J5.4 J6.4 J7.4 J8.4 P1.1 P2.3 P3.3 P4.3 P5.5 P5.6 Q2.2(E) Q3.2(E) Q5.2(E) Q6.2(E) Q8.2(E) Q9.1(ANODE) Q10.1(ANODE) Q11.2(E) Q12.2(E) Q13.2(E) Q14.1(ANODE) Q15.2(E) Q16.2(E) Q17.2(E) R10.1 R14.1 R19.1 R20.2 R22.1 R35.2 R38.1 R42.1 R43.2 R44.1 R56.1 R58.1 R60.1 R62.1 R63.1 R67.1 R70.1 R81.1 R87.1 R94.1 R95.1 R114.1 R117.2 S1.1 S2.1 S3.1 U1.4(GND) U2.1(GND) U3.7(GND) U4.5(GND) U5.8(GND) U5.13(GND) U5.19(GND) U5.21(GND) U5.27(USB_GND) U5.30(GND) U5.31(GND) U5.33(GND) U5.37(GND) U5.45(GND) U5.66(GND) U5.67(GND) U5.69(GND) U5.70(GND) U5.71(GND) U5.72(GND) U5.73(GND) U5.74(GND) U5.75(GND) U5.76(GND) U5.77(GND) U6.2(LED_Cathode) U7.1(VSS) U8.2(PGND) U8.3(GND) U9.7(GND) U10.2(GND) U11.12(VSSA) U11.18(VSS4) U11.31(VSS1) U11.47(VSS2) U11.63(VSS3) U12.4 U13.1(1OE) U13.4(2OE) U13.7(GND) U13.10(3OE) U13.13(4OE) U14.6(VSS) U14.9 U14.10 U14.11 U14.12 XS1.1 XS3.1 XS4.1 XS5.4(GND) XS6.4 XS7.1 Y2.2 Y2.4
GROUND: D5.2(K) D13.1(A) GROUND1.1
SIM_VCC: C7.2 IC2.4(I/O3) U5.18(SIM1_VDD) XS5.1(SIM_VCC) XS5.5(CCVPP)
TF-3V3: C70.1 R99.2 U13.14(VCC) U14.4(VDD)
VBAT: C39.2 C40.2 C41.2 C42.2 C53.2 D7.1(A) R61.2 R83.2 RCS1.1 RCS2.1 U8.14(BAT) XS4.2
VCC5V: C44.2 F5.2 IC5.1(VIN) IC5.3(EN) LED2.2(K) LED3.2(K) R48.2 R51.2
VDD_EXT: R25.2 R49.1 U5.40(VDD_EXT)
VRTC: R37.2 R102.1 U11.1(VBAT)
1Y: R13.2 U3.2(1Y) U3.11(5Y)
2A: U3.3(2A) U3.8(4A)
12V_PWR: R11.1 U11.37(PC6/TIM3_CH1)
485_PWR_EN: R39.1 U11.38(PC7/TIM3_CH2)
485RX: R3.1 U11.17(PA3/USART2_RX_/ADC12_IN3/TIM2_CH4)
485TX: R2.1 U11.16(PA2/USART2_TX/ADC12_IN2/TIM2_CH3)
A: F4.2 J1.3 J2.3 J3.3 J4.3 J5.3 J6.3 J7.3 J8.3 R5.2 U1.7(A+)
ANT_PWR_EN: R24.1 U11.53(PC12/USART3_CK)
AUX: Q13.1(B) R77.1 U9.5(AUX)
B: F3.2 J1.2 J2.2 J3.2 J4.2 J5.2 J6.2 J7.2 J8.2 R5.1 U1.6(B-)
BAT_V: C54.2 R83.1 R87.2 U11.27(PB1/ADC12_IN9/TIM3_CH4/TIM1_CH3N)
BOOT0: R116.2 U11.60(BOOT0)
BOOT1: R115.1 U11.28(PB2-BOOT1)
CS: R113.2 U11.33(PB12/SPI2_NSS/I2C2_SMBA/USART3_CK/TIM1_BKIN)
CS-CARD: U13.8(3Y) U14.2(CD/DAT3)
D0: R110.2 U14.7(DAT0)
D+: D26.A R104.1 R111.1 U12.3
D-: R103.1 U12.2
DI: U13.3(1Y) U14.3(CMD)
END_CHG: LED1.1(A) U8.5(~{DONE})
EX_POW: R42.2 U6.3(Emitter) U11.39(PC8/TIM3_CH3)
GNSS_EN: R27.2 U5.59(GNSS_EN)
GPRS_PWR_EN: R59.1 U11.56(PB4/JNTRST/TIM3_CH1/SPI1_MISO)
GPRS_PWRKEY: R45.1 U11.52(PC11/USART3_RX)
GPRS_RST: Q5.3(C) R49.2 S3.2 U5.39(PWRKEY) U11.51(PC10/USART3_TX)
GPRS_RX: D14.2(K) R22.2 U11.30(PB11/I2C2_SDA/USART3_RX/TIM2_CH4)
GPRS_TX: D15.2(K) U11.29(PB10/I2C2_SCL/USART3_TX/TIM2_CH3)
GPS_RXD: R29.1 U5.22(UART2_TXD)
GPS_TXD: R30.1 U5.23(UART2_RXD)
I1: Q9.3(C/A) R69.2 U11.24(PC4/ADC12_IN14)
I2: Q10.3(C/A) R74.2 U11.23(PA7/SPI1_MISI_/TIM1_CH1N/ADC12_IN7/TIM3_CH2)
I3: Q14.3(C/A) R93.2 U11.22(PA6/SPI1_MISO_/TIM1_BKIN/ADC12_IN6/TIM3_CH1)
IIN1: C48.2 P2.2 R68.2 R69.1 R70.2
IIN2: C50.2 P3.2 R73.2 R74.1 R81.2
IIN3: C57.2 P4.2 R92.2 R93.1 R95.2
K1: R46.2 S2.2 U11.20(PA4/SPI1_NSS/_USART2_CK/ADC12_IN4)
K2: R34.2 S1.2 U11.21(PA5/SPI1_SCK_/ADC12_IN5)
LED1: R79.1 U11.10(PC2/ADC12_IN12)
LED2: R90.1 U11.11(PC3/ADC12_IN13)
LED3: R80.1 U11.8(PC0/ADC12_IN10)
LED4: R91.1 U11.9(PC1/ADC12_IN11)
LoRa_AUX: Q13.3(C) R78.1 U11.14(PA0/WKUP/USART2_CTS/ADC12_IN0_/TIM2_CH1_ETR)
LoRa_M0: U9.1(M0) U11.54(PD2/TIM3_ETR)
LoRa_M1: U9.2(M1) U11.55(PB3/JTDO/TRACESWO/TIM2_CH2/SPI1_SCK)
LORA_PWR: R88.1 U11.61(PB8/I2C_1_SCL/_CAN_RX/TIM4_CH3)
LoRa_RX: R109.2 U9.3(RXD) XS6.3  [also labelled MCU_TX]
LoRa_TX: R89.2 R105.2 U9.4(TXD) XS6.2  [also labelled MCU_RX]
MISO: U11.35(PB14/SPI2_MISO/TIM1_CH2N/USART3_RTS) U13.11(4Y)
MOSI: R107.1 U11.36(PB15/SPI2_MOSI/TIM1_CH3N)
NETLIGHT: R26.1 U5.41(NETLIGHT) U11.50(PA15/JTDI/TIM2_CH1_CH1/_SPI1_NSS)
ON_CHG: LED1.3(A) U8.4(~{CHRG})
RESET: C71.1 R108.2 U11.7(NRST) XS7.2
RTC_SCL: IC8.6(SCL) R97.1 U11.58(PB6/USART1_TX/I2C1_SCL_/TIM4_CH1)
RTC_SDA: IC8.5(SDA) R98.1 U11.59(PB7/USART1_RX/I2C1_SDA_/TIM4_CH2)
RXD: R3.2 U1.3(RXD) U3.4(2Y) U3.5(3A)
SCK: R112.1 U11.34(PB13/SPI2_SCK/USART3_CTS/_TIM1_CH1N)
SCLK: U13.6(2Y) U14.5(CLX)
SIM800_RX: D15.1(A) P1.2 R25.1 U5.2(UART1_RXD)
SIM800_TX: D14.1(A) P1.3 U5.1(UART1_TXD)
SIM_CLK: C4.1 IC2.1(I/O1) U5.16(SIM1_CLK) XS5.3(SIM_CLK)
SIM_DAT: C6.2 IC2.3(I/O2) U5.15(SIM1_DATA) XS5.6(SIM_DAT)
SIM_RST: C5.1 IC2.5(I/O4) U5.17(SIM1_RST) XS5.2(SIM_RST)
SWCLK: U11.49(PA14/JTCK-SWCLK) XS7.4
SWDIO: U11.46(PA13/JTMS-SWDIO) XS7.3
TXD: R2.2 R9.1 U1.2(TXD) U3.1(1A)
USBDM: R103.2 U11.44(PA11/USART1_CTS/USBDM_/CAN_RX_/TIM1_CH4)
USBDP: R104.2 U11.45(PA12/USART1_RTS/USBDP/CAN_TX_/TIM1_ETR)
USBEN: R106.2 U11.40(PC9/TIM3_CH4)
VIN1: P2.1 R68.1
VIN2: P3.1 R73.1
VIN3: P4.1 R92.1
WP: IC8.7(WP) R96.1 U11.57(PB5/TIM3_CH2/SPI1_MOSI_/_I2C1_SMBA)
Net1_1: 1.1 C2.2 IC1.5(VOUT) R1.1
Net2_1: 2.1 C9.1 C10.2 C11.2 D1.2(K) D3.2(K) R4.1 R7.2
Net+1_1: +1.1 Q4.2(D) R31.1
NetC3_2: C3.2 IC1.4(BYP)
NetC12_1: C12.1 D10.1 R18.2 U3.13(6Y)
NetC16_1: C16.1 C17.2 D2.1(A) Q1.2(D) R12.2 U2.4(VIN)
NetC20_1: C20.1 IC3.3(VCC) R36.2
NetC21_1: C21.1 IC3.2(BST)
NetC21_2: C21.2 D19.2(K) IC3.1(SW) L3.1
NetC22_2: C22.2 D18.2(K) R32.1 R38.2 U6.1(LED_Anode)
NetC27_1: C27.1 R47.2
NetC28_2: C28.2 MCU_1.1 R51.1 U7.2(Vout)
NetC29_1: C29.1 C30.2 D25.2(K) IC4.2(VIN) R52.2 R54.2
NetC31_2: C31.2 C34.1 IC4.4(OUT) R53.1 R55.2
NetC32_2: C32.2 D23.2(K) R50.2 U7.3(Vin)
NetC35_1: C35.1 U8.1(VG)
NetC38_1: C38.1 U8.11(COM3)
NetC41_1: C41.1 R61.1 R63.2 U8.10(FB)
NetC43_2: C43.2 U8.8(COM1)
NetC45_2: C45.2 IC5.5(VOUT) MCU_2.1 R64.1
NetC46_2: C46.2 IC5.4(BYP)
NetC47_2: C47.2 R66.1
NetC49_1: C49.1 IC6.1(VIN) R75.2 R82.1
NetC51_2: C51.2 IC6.5(VOUT) LoRa-3V3.1 R76.1
NetC52_2: C52.2 IC6.4(BYP)
NetC60_1: C60.1 IC7.1(VIN) R100.2 R101.1
NetC61_2: C61.2 IC7.5(VOUT) R99.1 TF-1.1
NetC63_2: C63.2 IC7.4(BYP)
NetC64_1: C64.1 U11.4(PC15/OSC32_OUT) Y1.1
NetC65_1: C65.1 U11.3(PC14/OSC32_IN) Y1.2
NetC68_1: C68.1 U11.6(PD1/OSC_OUT) Y2.1
NetC69_1: C69.1 U11.5(PD0/OSC_IN) Y2.3
NetC72_2: C72.2 R114.2 U12.5
NetD1_1: D1.1(A) D3.1(A) L1.2 U2.0 U2.3(SW)
NetD2_2: D2.2(K) L1.1
NetD4_2: D4.2(K) D6.1(A) D8.1(A) F2.2
NetD5_1: D5.1(A) D9.1(A) F3.1 R10.2 U4.7(B)
NetD6_2: D6.2(K) D7.2(K) XS2.1
NetD9_2: D9.2(K) D13.2(K) F4.1 R21.2 U4.6(A)
NetD10_2: D10.2 R18.1 U3.10(5A) U4.4(DI)
NetD11_A: D11.A R13.1
NetD12_A: D12.A R17.1
NetD16_A: D16.A R26.2
NetD17_A: D17.A R28.2
NetD20_2: D20.2(K) D21.2(K) D22.2(K) D24.2(K) L4.1 R47.1
NetD22_1: D22.1(A) D24.1(A) Q7.2(D)
NetD26_K: D26.K R117.1
NetE1_2: E1.2 L2.2 R15.2
NetE2_2: E2.2 U5.32(GSM_ANT)
NetE3_1: E3.1 E3.3 U9.8(GND)
NetE3_2: E3.2 U9.9(ANT)
NetF1_1: F1.1 XS1.2
NetF2_1: F2.1 XS3.2
NetF5_1: F5.1 U12.1
NetIC3_5: IC3.5(FB) R35.1 R40.2
NetIC3_6: IC3.6(PG) R36.1
NetIC3_7: IC3.7(EN) R41.2
NetIC4_1: IC4.1(EN) R54.1
NetIC4_5: IC4.5(ADJ) R55.1 R58.2
NetIC6_3: IC6.3(EN) R82.2
NetIC7_3: IC7.3(EN) R101.2
NetL2_1: L2.1 R8.1
NetL4_2: L4.2 RCS1.2 RCS2.2 U8.13(CSP)
NetLED1_2: LED1.2(K) R48.1
NetLED2_1: LED2.1(A) R71.2
NetLED2_3: LED2.3(A) R85.2
NetLED3_1: LED3.1(A) R72.2
NetLED3_3: LED3.3(A) R86.2
NetP5_3: P5.3 R115.2
NetP5_4: P5.4 R116.1
NetQ1_1: Q1.1(G) Q2.3(C) R6.1
NetQ2_1: Q2.1(B) R11.2 R19.2
NetQ3_1: Q3.1(B) R20.1 R24.2
NetQ3_3: Q3.3(C) R16.2 V1.1(G)
NetQ4_1: Q4.1(G) Q6.3(C) R33.2
NetQ5_1: Q5.1(B) R43.1 R45.2
NetQ6_1: Q6.1(B) R39.2 R44.2
NetQ7_1: Q7.1(G) U8.16(DRV)
NetQ8_1: Q8.1(B) R59.2 R67.2
NetQ8_3: Q8.3(C) R57.2 V2.1(G)
NetQ11_1: Q11.1(B) R79.2
NetQ11_3: Q11.3(C) R71.1
NetQ12_1: Q12.1(B) R80.2
NetQ12_3: Q12.3(C) R72.1
NetQ15_1: Q15.1(B) R88.2 R94.2
NetQ15_3: Q15.3(C) R84.2 V3.1(G)
NetQ16_1: Q16.1(B) R90.2
NetQ16_3: Q16.3(C) R85.1
NetQ17_1: Q17.1(B) R91.2
NetQ17_3: Q17.3(C) R86.1
NetQ18_1: Q18.1(B) R106.1
NetQ18_3: Q18.3(C) R111.2
NetR7_1: R7.1 R14.2 U2.5(FB)
NetR8_2: R8.2 V1.3(D)
NetR12_1: R12.1 U2.2(EN)
NetR15_1: R15.1 U5.68(GPS_ANT)
NetR17_2: R17.2 U3.6(3Y)
NetR23_2: R23.2 U3.9(4Y) U4.1(RO)
NetR27_1: R27.1 U5.57(GPIO1)
NetR28_1: R28.1 U5.42(STATUS)
NetR29_2: R29.2 U5.62(GPS_RXD)
NetR30_2: R30.2 U5.61(GPS_TXD)
NetR37_1: R37.1 U5.28(VRTC)
NetR52_1: R52.1 V2.3(D)
NetR60_2: R60.2 U8.6(TEMP)
NetR62_2: R62.2 R65.1 U8.7(MPPT)
NetR66_2: R66.2 U8.9(COM2)
NetR75_1: R75.1 V3.3(D)
NetR102_2: R102.2 U10.1(VCC)
NetR105_1: R105.1 U11.43(PA10/USART1_RX/TIM1_CH3)
NetR107_2: R107.2 U13.2(1A)
NetR109_1: R109.1 U11.42(PA9/USART1_TX/TIM1_CH2)
NetR110_1: R110.1 U13.12(4A)
NetR112_2: R112.2 U13.5(2A)
NetR113_1: R113.1 U13.9(3A)
NetU3_12: U3.12(6A) U4.2(~{RE}) U4.3(DE)

Not connected (* = marked no-connect by the designer): HO1 0; HO2 0; HO3 0; HO4 0; IC8 1(NC) 3(NC); U1 5(G); U5 3(UART1_RTS) 4(UART1_CTS) 5(UART1_DCD) 6(UART1_DTR) 7(UART1_RI) 9(MICP) 10(MICN) 11(SPK1P) 12(SPK1N) 14(SIM1_DET) 20(BT_ANT) 24(USB_VBUS) 25(USB_DP) 26(USB_DM) 29(RF_SYNC) 36(GND) 38(ADC) 43(SPK2N) 44(SPK2P) 46(MCCA3) 47(MCCA2) 48(MCCA1) 49(MCCA0) 50(MCCK) 51(MCCMO) 52(SIM2_DET) 53(SIM2_DATA) 54(SIM2_CLK) 55(SIM2_RST) 56(SIM2_VDD) 58(GPIO2) 60(1PPS) 63(GND) 64(SDA) 65(SCL); U8 12(NC); U9 10(GND)* 11(GND)*; U11 2(PC13/TAMPER-RTC) 15(PA1/USART2_RTS_/ADC12_IN1/TIM2_CH2) 25(PC5/ADC12_IN15) 26(PB0/ADC12_IN8/TIM3_CH3/TIM1_CH2N) 41(PA8/USART1_CK/TIM1_CH1/MCO) 62(PB9/I2C_1_SDA/CAN_TX/TIM4_CH4); U14 1(DAT2)* 8(DAT1)*

## Notes on the sheet
- 太阳能
- DC座
- 电源开关
- (near XS4) 电池
- Vout=1.25*(1+R2/R1)
- 全部改成RJ12水晶头座4P
- 12.5V=1.25*(1+180K/20K)
- 485电源模块
- D16
- 灯熄灭  模块没有运行
- 64ms亮/800ms熄   模块没有注册到网络
- 64ms亮/3000ms熄   模块注册到网络
- 12V升压模块
- {
- 64ms亮/300ms熄  模块GPRS点对点通信建立
- 外接端子
- 485总线接口
- D12 模块电源状态
- 外部输入电源检测
- 5V电源
- 485外设电源开关
- 功能按键
- 电阻RCS1与RCS2共同决定电流大小
- 也可以只使用一个
- GPRS_RESET
- (near LED1) 充电指示灯
- (near LED1) 绿
- (near LED1) 红
- 3A＝0.067Ω
- 2A＝0.1Ω
- 1A＝0.2Ω
- 定位安装孔
- 4A＝0.05Ω
- 5A＝0.04Ω
- Vmppt＝1.04×(1＋R95／R96)
- 16V＝1.04×(1＋68K／4.7K)
- 8.4V＝2.416×(1＋24.9K／10K)＋50nA×24.9K
- Vbat＝2.416×(1＋R58／R59)＋50nA×R58
- 12V＝1.04×(1＋105K／10K)
- 太阳能充电模块
- 4V电源
- 单片机电源
- (near R69) 1
- (near LoRa-3V3) 3.3V
- (near LED2) 绿
- (near LED3) 绿
- (near R74) 2
- (near LED2) 红
- (near LED3) 红
- (near R93) 3
- LORa电源
- 电池电压检测
- 状态指示灯
- 网络指示灯
- LORa模块
- 模拟输入接口
- (near IC8) EEPOM
- (near R102) 纽扣电池
- TF电源
- USB调试接口
- BOOT启动模式选择
- 电平转换电路
- arduino Adc:PA0,PA1,PA2,PA3,PA4,PA5,PA6,PA7,PB0,PB1,PC0,PC1,PC2,PC3,PC4,PC5
- arduino PWMPin:PA0,PA1,PA2,PA3,PA6,PA7,PA8,PA9,PA10,PB0,PB1,PB6,PB7,PB8,PB9,PC6,PC7,PC8,PC9
- 单片机STM32F103RCT6
- 程序下载接口
- 单片机调试串口
- TF卡
- (in symbol SIM868-DS) UART1; UART2; GPIO; SD CARD; USB; GPS; I2C; OTHERS; AUDIO; SIM

## Library data of the parts
1 GND3 MCU_2 = TEST_POINT
2-4 +1 GND1 GND2 GND4 GROUND1 LoRa-3V3 MCU_1 TF-1 = TEST_POINT: 测试点
C1 C2 C11 C14 C17 C20 C28 C30 C32 C40 C44 C45 C49 C51 C56 C59-C61 = 0603 1uF (105) 10% 50V: 贴片电容; ComponentLink1Description: 供应商链接; ComponentLink1URL: http://www.szlcsc.com/product/details_16531.html; Package: 0603; Supplier: LC; SuppliersPartNumber: C15849
C3 C46 = 0603 22nF (223) 10% 50V: 贴片电容; ComponentLink1Description: 供应商链接; ComponentLink1URL: http://www.szlcsc.com/product/details_21834.html; Package: 0603; Supplier: LC; SuppliersPartNumber: C21122
C4-C7 = 0603 47pF (470) 5% 50V: 贴片电容; ComponentLink1Description: 供应商链接; ComponentLink1URL: http://www.szlcsc.com/product/details_2023.html; Package: 0603; Supplier: LC; SuppliersPartNumber: C1671
C8 C10 C12 C15 C19 C21 C31 C33 C35 C38 C48 C50 C54 C55 C57 C58 C62 C67 C70-C73 C75 C77 = 0603 100nF (104) 10% 50V: 贴片电容; ComponentLink1Description: 供应商链接; ComponentLink1URL: http://www.szlcsc.com/product/details_15331.html; Package: 0603; Supplier: LC; SuppliersPartNumber: C14663
C9 C16 C26 C34 C36 = Cap -8*10.5: 贴片铝电解电容; Value: 1000uF/6V3; Published: 8-Jun-2000; LatestRevisionDate: 17-Jul-2002; LatestRevisionNote: Re-released for DXP Platform.; PackageReference: RB7.6-15; Publisher: Altium Limited
C13 C18 C25 C29 = Cap -6.3*7.7: 贴片铝电解电容; Value: 1000uF/6V3; Published: 8-Jun-2000; LatestRevisionDate: 17-Jul-2002; LatestRevisionNote: Re-released for DXP Platform.; PackageReference: RB7.6-15; Publisher: Altium Limited
C22 C42 C52 C63 = 0603 10nF (103) 10% 50V: 贴片电容; ComponentLink1Description: 供应商链接; ComponentLink1URL: http://www.szlcsc.com/product/details_58143.html; Package: 0603; Supplier: LC; SuppliersPartNumber: C57112
C23 C24 = Cap: 贴片电容; Value: 22uF; Published: 8-Jun-2000; LatestRevisionDate: 17-Jul-2002; LatestRevisionNote: Re-released for DXP Platform.; PackageReference: RAD-0.3; Publisher: Altium Limited; PackageDescription: Radial Cap, Thru-Hole; 2 Leads; 0.3 in Pin Spacing
C27 = 0603 220pF (221) 10% 50V: 贴片电容; ComponentLink1Description: 供应商链接; ComponentLink1URL: http://www.szlcsc.com/product/details_1955.html; Package: 0603; Supplier: LC; SuppliersPartNumber: C1603
C37 C39 C53 = 1206 10uF (106) 10% 50V: 贴片电容; ComponentLink1Description: 供应商链接; ComponentLink1URL: http://www.szlcsc.com/product/details_14236.html; Package: 1206; Supplier: LC; SuppliersPartNumber: C13585
C41 = 0603 33pF (330) 5% 50V: 贴片电容; ComponentLink1Description: 供应商链接; ComponentLink1URL: http://www.szlcsc.com/product/details_2015.html; Package: 0603; Supplier: LC; SuppliersPartNumber: C1663
C43 = 0603 470pF (471) 10% 50V: 贴片电容; ComponentLink1Description: 供应商链接; ComponentLink1URL: http://www.szlcsc.com/product/details_1972.html; Package: 0603; Supplier: LC; SuppliersPartNumber: C1620
C47 = 0603 220nF (224) 10% 25V: 贴片电容; ComponentLink1Description: 供应商链接; ComponentLink1URL: http://www.szlcsc.com/product/details_21832.html; Package: 0603; Supplier: LC; SuppliersPartNumber: C21120
C64 C65 = 0603 6pF (6R0) 0.25pF 50V: 贴片电容; ComponentLink1Description: 供应商链接; ComponentLink1URL: http://www.szlcsc.com/product/details_38453.html; Package: 0603; Supplier: LC; SuppliersPartNumber: C37474
C66 C74 C76 C78 = 0603 10uF (106) 10% 10V: 贴片电容; ComponentLink1Description: 供应商链接; ComponentLink1URL: http://www.szlcsc.com/product/details_20411.html; Package: 0603; Supplier: LC; SuppliersPartNumber: C19702
C68 C69 = 0603 20pF (200) 5% 50V: 贴片电容; ComponentLink1Description: 供应商链接; ComponentLink1URL: http://www.szlcsc.com/product/details_2000.html; Package: 0603; Supplier: LC; SuppliersPartNumber: C1648
D1-D3 D6-D8 D19-D22 D24 = SMA(DO-214AC) SS54: 二极管; ComponentLink1Description: 供应商链接; ComponentLink1URL: http://www.szlcsc.com/product/details_23178.html; Package: SMA(DO-214AC); Supplier: LC; SuppliersPartNumber: C22452
D4 = SMAJ30A: TVS二极管; Published: 8-Jun-2000; LatestRevisionDate: 17-Jul-2002; LatestRevisionNote: Re-released for DXP Platform.; DatasheetVersion: 1998; PackageVersion: Aug-1999; PackageReference: DO-41; Publisher: Altium Limited; PackageDescription: Diode, Axial; Body 5.2 x 2.7 mm (LxDia. max), Lead Dia. 0.86 mm (max); Code_JEDEC: DO-204-AL; ComponentLink1Description: SMAJ30A; ComponentLink1URL: https://item.szlcsc.com/159563.html
D5 D9 D13 = Diode: 通用二极管; Published: 8-Jun-2000; LatestRevisionDate: 17-Jul-2002; LatestRevisionNote: Re-released for DXP Platform.; PackageDocument: Sep-1996; PackageReference: SMC; Publisher: Altium Limited; Code_JEDEC: DO-214-AB
D10 = Diode Zener: 稳压二极管; Published: 8-Jun-2000; LatestRevisionDate: 17-Jul-2002; LatestRevisionNote: Re-released for DXP Platform.; PackageReference: DIODE-0.7; Publisher: Altium Limited; PackageDescription: Diode, Thru-Hole; 2 Leads; 0.7 in Pin Spacing
D11 D16 = 0603 红灯: 发光二极管; ComponentLink1Description: 供应商链接; ComponentLink1URL: http://www.szlcsc.com/product/details_2659.html; Package: 0603; Supplier: LC; SuppliersPartNumber: C2286
D12 = 0603 蓝灯: 发光二极管; ComponentLink1Description: 供应商链接; ComponentLink1URL: http://www.szlcsc.com/product/details_73150.html; Package: 0603; Supplier: LC; SuppliersPartNumber: C72041
D14 D15 = Diode: 开关二极管; Published: 8-Jun-2000; LatestRevisionDate: 17-Jul-2002; LatestRevisionNote: Re-released for DXP Platform.; PackageDocument: Sep-1996; PackageReference: SMC; Publisher: Altium Limited; Code_JEDEC: DO-214-AB
D17 D26 = 0603 绿灯: 发光二极管; ComponentLink1Description: 供应商链接; ComponentLink1URL: http://www.szlcsc.com/product/details_73152.html; Package: 0603; Supplier: LC; SuppliersPartNumber: C72043
D18 = Diode 1N4001: 二极管; Published: 8-Jun-2000; LatestRevisionDate: 17-Jul-2002; LatestRevisionNote: Re-released for DXP Platform.; DatasheetVersion: 1998; PackageVersion: Aug-1999; PackageReference: DO-41; Publisher: Altium Limited; PackageDescription: Diode, Axial; Body 5.2 x 2.7 mm (LxDia. max), Lead Dia. 0.86 mm (max); Code_JEDEC: DO-204-AL; ComponentLink1Description: Manufacturer Link; ComponentLink1URL: http://www.fairchildsemi.com/; ComponentLink2Description: Datasheet; ComponentLink2URL: http://www.fairchildsemi.com/ds/1N%2F1N4001.pdf
D23 D25 = D Schottky: TVS二极管; Code - JEDEC: DO-214-AA; Published: 8-Jun-2000; Revision: July-2002: Re-released for DXP Platform.; Publisher: Altium Limited
E1-E3 = Header 3H: 天线座IPEX; LatestRevisionDate: 17-Jul-2002; LatestRevisionNote: Re-released for DXP Platform.; Publisher: Altium Limited
F1-F5 = Fuse: 贴片保险丝; Published: 8-Jun-2000; LatestRevisionDate: 17-Jul-2002; LatestRevisionNote: Re-released for DXP Platform.; PackageReference: PIN-W2/E2.8; Publisher: Altium Limited
IC1 IC5 = CAT6219: 低压差线性稳压(LDO)
IC2 = ESDA6V8AV5: 防静电
IC3 = MP2482: DC-DC芯片
IC4 = MIC29302WU: LDO
IC6 IC7 = CAT6219: 3.3V降压
IC8 = AT24C1024: EEPROM
J1-J8 = RJ11电话插座P4
L1 = INDUCTOR: 磁环电感
L2 = Inductor: 贴片电感; ComponentLink1URL: http://www.szlcsc.com/product/details_27872.html; Package: 0402; Supplier: LC; SuppliersPartNumber: C27123
L3 = Inductor Iron: 功率电感; Published: 24-Mar-1999; LatestRevisionDate: 17-Jul-2002; LatestRevisionNote: Re-released for DXP Platform.; PackageReference: AXIAL-0.9; Publisher: Altium Limited; PackageDescription: Axial Device, Thru-Hole; 2 Leads; 0.9 in Pin Spacing; Value: 4.7uH
L4 = INDUCTOR: 功率电感
LED1-LED3 = LED2_双色共阳: 1.27卧式贴片针座
P1 = Header 3H: 单排插针; LatestRevisionDate: 17-Jul-2002; LatestRevisionNote: Re-released for DXP Platform.; Publisher: Altium Limited
P2-P4 = WJ2EDGR-5.08-3: 插针; LatestRevisionDate: 17-Jul-2002; LatestRevisionNote: Re-released for DXP Platform.; Publisher: Altium Limited
P5 = Header 2*3: 双排插针; LatestRevisionDate: 17-Jul-2002; LatestRevisionNote: Re-released for DXP Platform.; Publisher: Altium Limited
Q1 Q4 Q7 = AOD413A: MOS(场效应管)
Q2 Q3 Q5 Q6 Q8 Q11-Q13 Q15-Q17 = SS8050: NPN贴片三极管; Published: 8-Jun-2000; LatestRevisionDate: 15-Jan-2003; LatestRevisionNote: PCB Footprint 'BCY-W3/D4.7' replaced; DatasheetDocument: 1997; PackageDocument: Sep-1998; PackageReference: TO-92A; Publisher: Altium Limited; Code_JEDEC: TO-92A; ComponentLink1Description: Manufacturer Link; ComponentLink1URL: http://www.fairchildsemi.com/; ComponentLink2Description: Datasheet; ComponentLink2URL: http://www.fairchildsemi.com/ds/2N%2F2N3904.pdf
Q9 Q10 Q14 = BAT54S: 肖特基二极管
Q18 = SS8550: PNP贴片三极管; Published: 8-Jun-2000; LatestRevisionDate: 15-Jan-2003; LatestRevisionNote: PCB Footprint 'BCY-W3/D4.7' replaced; DatasheetDocument: 1997; PackageDocument: Sep-1998; PackageReference: TO-92A; Publisher: Altium Limited; Code_JEDEC: TO-92A; ComponentLink1Description: Manufacturer Link; ComponentLink1URL: http://www.fairchildsemi.com/; ComponentLink2Description: Datasheet; ComponentLink2URL: http://www.fairchildsemi.com/ds/2N%2F2N3906.pdf
R1-R4 R15 R29-R31 R37 R50-R53 R64 R75 R76 R99 R100 R102 R105 R109 = 0603 0Ω (0R0) 1%: 贴片电阻; ComponentLink1Description: 供应商链接; ComponentLink1URL: http://www.szlcsc.com/product/details_21903.html; Package: 0603; Supplier: LC; SuppliersPartNumber: C21189
R5 R66 R70 R81 R95 = 0603 120Ω (1200) 1%: 贴片电阻; ComponentLink1Description: 供应商链接; ComponentLink1URL: http://www.szlcsc.com/product/details_23514.html; Package: 0603; Supplier: LC; SuppliersPartNumber: C22787
R6 R12 R16 R33 R36 R54 R55 R57 R77 R82-R84 R101 = 0603 100KΩ (1003) 1%: 贴片电阻; ComponentLink1Description: 供应商链接; ComponentLink1URL: http://www.szlcsc.com/product/details_26546.html; Package: 0603; Supplier: LC; SuppliersPartNumber: C25803
R7 = 0603 180KΩ (1803) 1%: 贴片电阻; ComponentLink1Description: 供应商链接; ComponentLink1URL: http://www.szlcsc.com/product/details_23554.html; Package: 0603; Supplier: LC; SuppliersPartNumber: C22827
R8 R103 R104 = 0603 22Ω (22R0) 1%: 贴片电阻; ComponentLink1Description: 供应商链接; ComponentLink1URL: http://www.szlcsc.com/product/details_24078.html; Package: 0603; Supplier: LC; SuppliersPartNumber: C23345
R9 R10 R21 R23 R42 R43 R45 = 0603 4.7KΩ (4701) 1%: 贴片电阻; ComponentLink1Description: 供应商链接; ComponentLink1URL: http://www.szlcsc.com/product/details_23889.html; Package: 0603; Supplier: LC; SuppliersPartNumber: C23162
R11 R24 R39 R59 R88 R107 R110 R112 R113 = 0603 3.3KΩ (3301) 1%: 贴片电阻; ComponentLink1Description: 供应商链接; ComponentLink1URL: http://www.szlcsc.com/product/details_23705.html; Package: 0603; Supplier: LC; SuppliersPartNumber: C22978
R13 R17 R26 R28 R32 R38 R48 R71 R72 R79 R80 R85 R86 R89-R91 R106 R111 R117 = 0603 1KΩ (1001) 1%: 贴片电阻; ComponentLink1Description: 供应商链接; ComponentLink1URL: http://www.szlcsc.com/product/details_21904.html; Package: 0603; Supplier: LC; SuppliersPartNumber: C21190
R14 R87 = 0603 20KΩ (2002) 1%: 贴片电阻; ComponentLink1Description: 供应商链接; ComponentLink1URL: http://www.szlcsc.com/product/details_4591.html; Package: 0603; Supplier: LC; SuppliersPartNumber: C4184
R18 = 0603 56KΩ (5602) 1%: 贴片电阻; ComponentLink1Description: 供应商链接; ComponentLink1URL: http://www.szlcsc.com/product/details_23933.html; Package: 0603; Supplier: LC; SuppliersPartNumber: C23206
R19 R20 R22 R25 R27 R34 R44 R46 R49 R60 R62 R63 R65 R67 R69 R74 R78 R93 R94 R96-R98 R108 R114-R116 = 0603 10KΩ (1002) 1%: 贴片电阻; ComponentLink1Description: 供应商链接; ComponentLink1URL: http://www.szlcsc.com/product/details_26547.html; Package: 0603; Supplier: LC; SuppliersPartNumber: C25804
R35 = 0603 75KΩ (7502) 1%: 贴片电阻; ComponentLink1Description: 供应商链接; ComponentLink1URL: http://www.szlcsc.com/product/details_23969.html; Package: 0603; Supplier: LC; SuppliersPartNumber: C23242
R40 = 0603 40.2KΩ (4022) 1%: 贴片电阻; ComponentLink1Description: 供应商链接; ComponentLink1URL: http://www.szlcsc.com/product/details_13081.html; Package: 0603; Supplier: LC; SuppliersPartNumber: C12447
R41 = 0603 1MΩ (1004) 1%: 贴片电阻; ComponentLink1Description: 供应商链接; ComponentLink1URL: http://www.szlcsc.com/product/details_23662.html; Package: 0603; Supplier: LC; SuppliersPartNumber: C22935
R47 = 0603 200Ω (2000) 1%: 贴片电阻; ComponentLink1Description: 供应商链接; ComponentLink1URL: http://www.szlcsc.com/product/details_8708.html; Package: 0603; Supplier: LC; SuppliersPartNumber: C8218
R56 = 0603 470Ω (4700) 1%: 贴片电阻; ComponentLink1Description: 供应商链接; ComponentLink1URL: http://www.szlcsc.com/product/details_23906.html; Package: 0603; Supplier: LC; SuppliersPartNumber: C23179
R58 = 0603 43KΩ (4302) 1%: 贴片电阻; ComponentLink1Description: 供应商链接; ComponentLink1URL: http://www.szlcsc.com/product/details_23899.html; Package: 0603; Supplier: LC; SuppliersPartNumber: C23172
R61 = 0603 24KΩ (2402) 1%: 贴片电阻; ComponentLink1Description: 供应商链接; ComponentLink1URL: http://www.szlcsc.com/product/details_24085.html; Package: 0603; Supplier: LC; SuppliersPartNumber: C23352
R68 R73 R92 = 0603 1.2KΩ (1201) 1%: 贴片电阻; ComponentLink1Description: 供应商链接; ComponentLink1URL: http://www.szlcsc.com/product/details_23492.html; Package: 0603; Supplier: LC; SuppliersPartNumber: C22765
RCS1 = R: 贴片电阻; Value: NC; Published: 8-Jun-2000; LatestRevisionDate: 17-Jul-2002; LatestRevisionNote: Re-released for DXP Platform.; PackageReference: AXIAL-0.4; Publisher: Altium Limited; PackageDescription: Axial Device, Thru-Hole; 2 Leads; 0.4 in Pin Spacing
RCS2 = R: 贴片电阻; Value: 0.12R; Published: 8-Jun-2000; LatestRevisionDate: 17-Jul-2002; LatestRevisionNote: Re-released for DXP Platform.; PackageReference: AXIAL-0.4; Publisher: Altium Limited; PackageDescription: Axial Device, Thru-Hole; 2 Leads; 0.4 in Pin Spacing
S1-S3 = SW-PB: 微型按键开关
U1 = RS485模块: TTL转RS485模块
U2 = XL6019: DC-DC芯片
U3 = 74HC14: 6路施密特触发反相器; LatestRevisionDate: 17-Jul-2002; LatestRevisionNote: Re-released for DXP Platform.; Publisher: Altium Limited
U4 = MAX485ESA: RS485收发芯片
U5 = SIM868-DS: GPRS+GPS
U6 = Q817: 光藕
U7 = RT9161-50GV: LDO
U8 = CN3722: 充电管理; LatestRevisionDate: 17-Jul-2002; LatestRevisionNote: Re-released for DXP Platform.; Publisher: Altium Limited
U9 = E32-TTL-100S1: LOAR-UART模块
U10 = BAT: CR2032电池盒/电池座
U11 = STM32F103RCT6: 单片机
U12 = USB_micro_5p
U13 = 74LVC125APW: 74系列逻辑芯片; BOM_Manufacturer: Nexperia; BOM_Manufacturer Part: 74LVC125APW,118; SMT Type: Extend; BOM_Supplier: LCSC; image: //image.lceda.cn/szlcsc/C6059.jpg; BOM_Supplier Part: C6059; BOM_LCSC Assembly: Yes; spicePre: U; ComponentLink1Description: 74LVC125APW; ComponentLink1URL: https://item.szlcsc.com/6525.html
U14 = TF-002T-15: TF002 TF卡座 高度1.5; BOM_Manufacturer: SOFNG; Contributor: LCSC; BOM_Supplier: LCSC; BOM_Manufacturer Part: TF-002T-15; BOM_Supplier Part: C125616; spicePre: C; ComponentLink1Description: TF002 TF卡座 高度1.5; ComponentLink1URL: https://item.szlcsc.com/136894.html
V1-V3 = MOSFET P: MOS(场效应管)
XS1-XS4 = WJ2EDGR-5.08-2: 接线座 - 接头; LatestRevisionDate: 17-Jul-2002; LatestRevisionNote: Re-released for DXP Platform.; Publisher: Altium Limited
XS5 = SIM_卡槽
XS6 = Hea: 1.27卧式贴片针座; LatestRevisionDate: 17-Jul-2002; LatestRevisionNote: Re-released for DXP Platform.; Publisher: Altium Limited
XS7 = Header 5: 1.27卧式贴片针座; LatestRevisionDate: 17-Jul-2002; LatestRevisionNote: Re-released for DXP Platform.; Publisher: Altium Limited
Y1 = CRYSTAL
Y2 = CRYSTAL: 晶振; LatestRevisionDate: 17-Jul-2002; LatestRevisionNote: Re-released for DXP Platform.; Publisher: Altium Limited